# EAGLE design Hauptplatine (EAGLE 9.6.2)
Assembly variants: 1

## Sheet 1 of 12
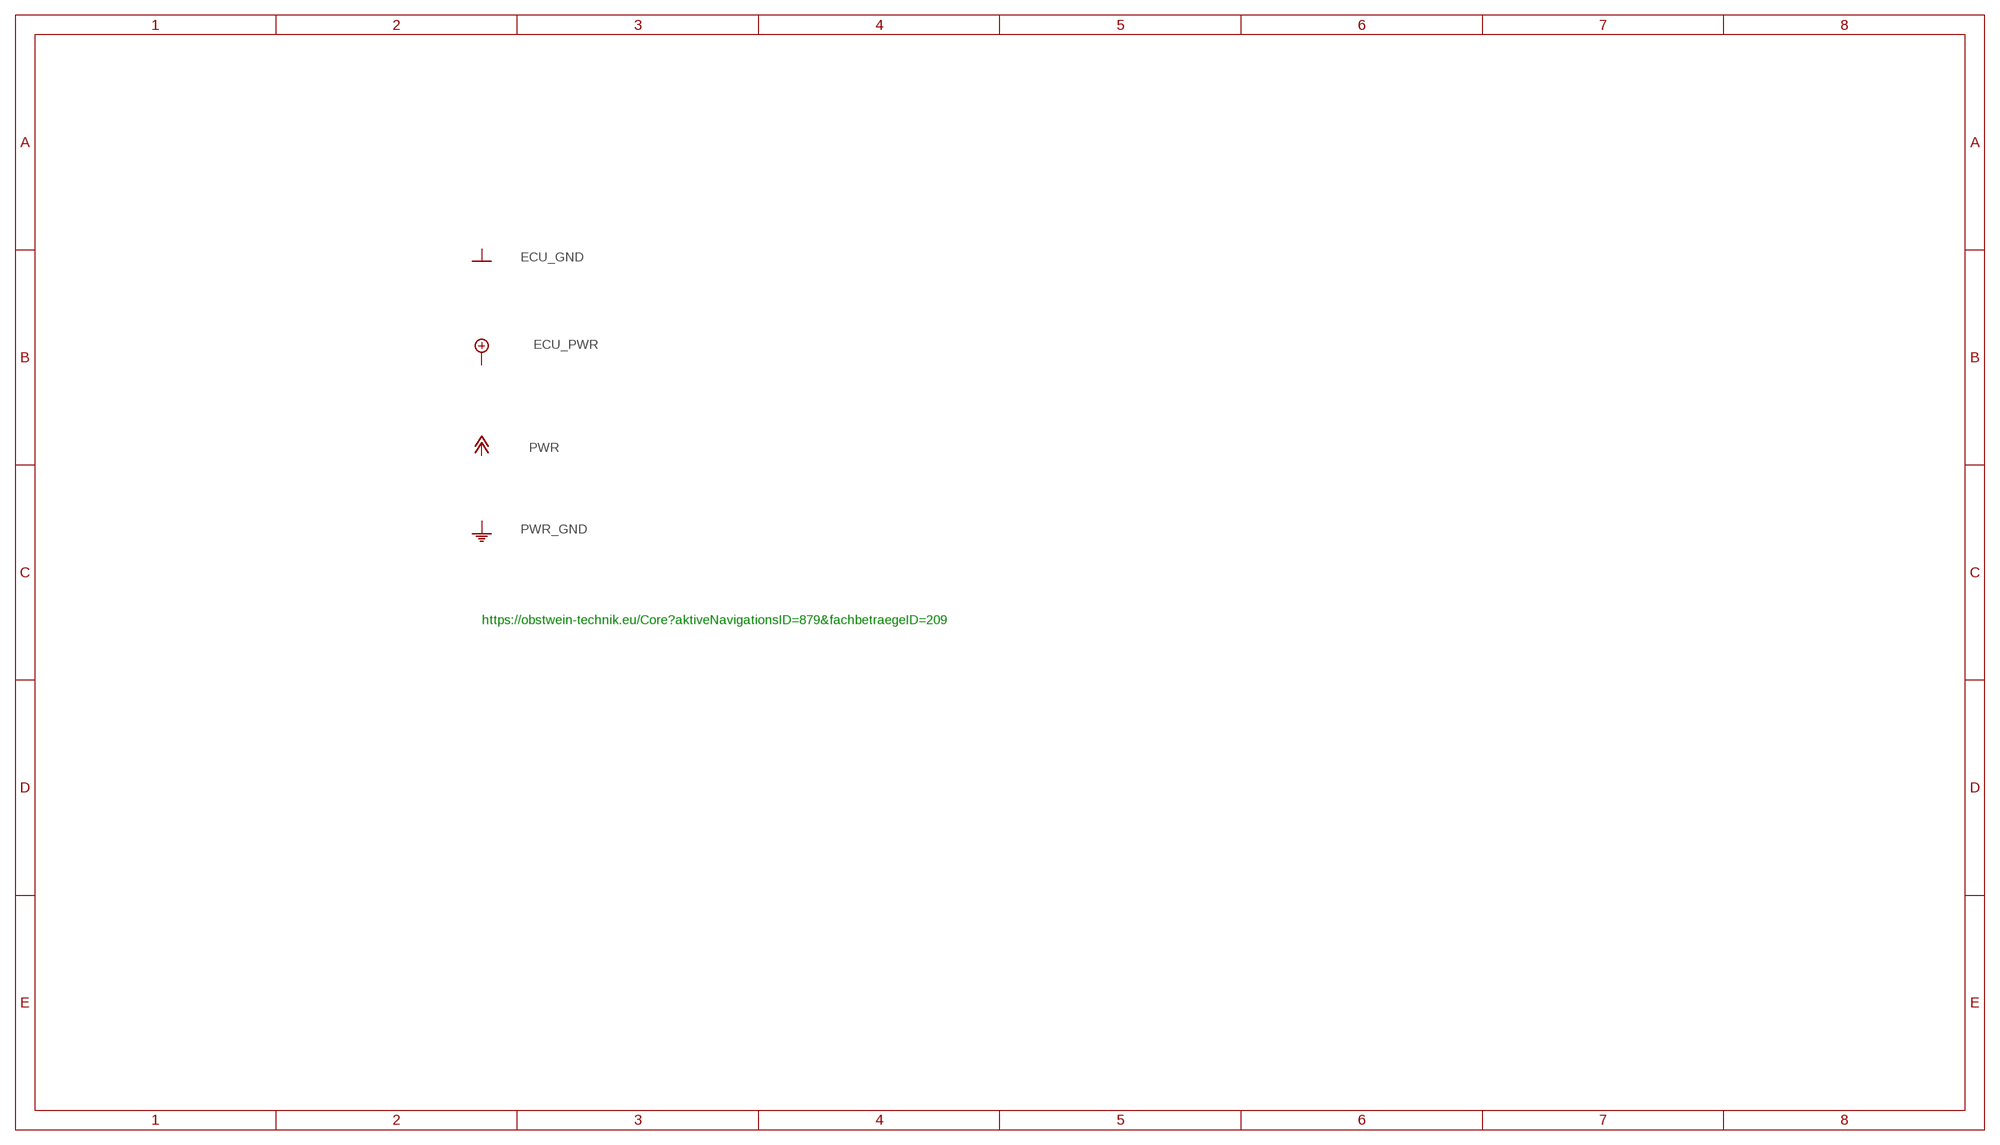
[diagram p0: schematic, sheet 1]

### Notes on the sheet
- https://obstwein-technik.eu/Core?aktiveNavigationsID=879&fachbetraegeID=209

## Sheet 2 of 12
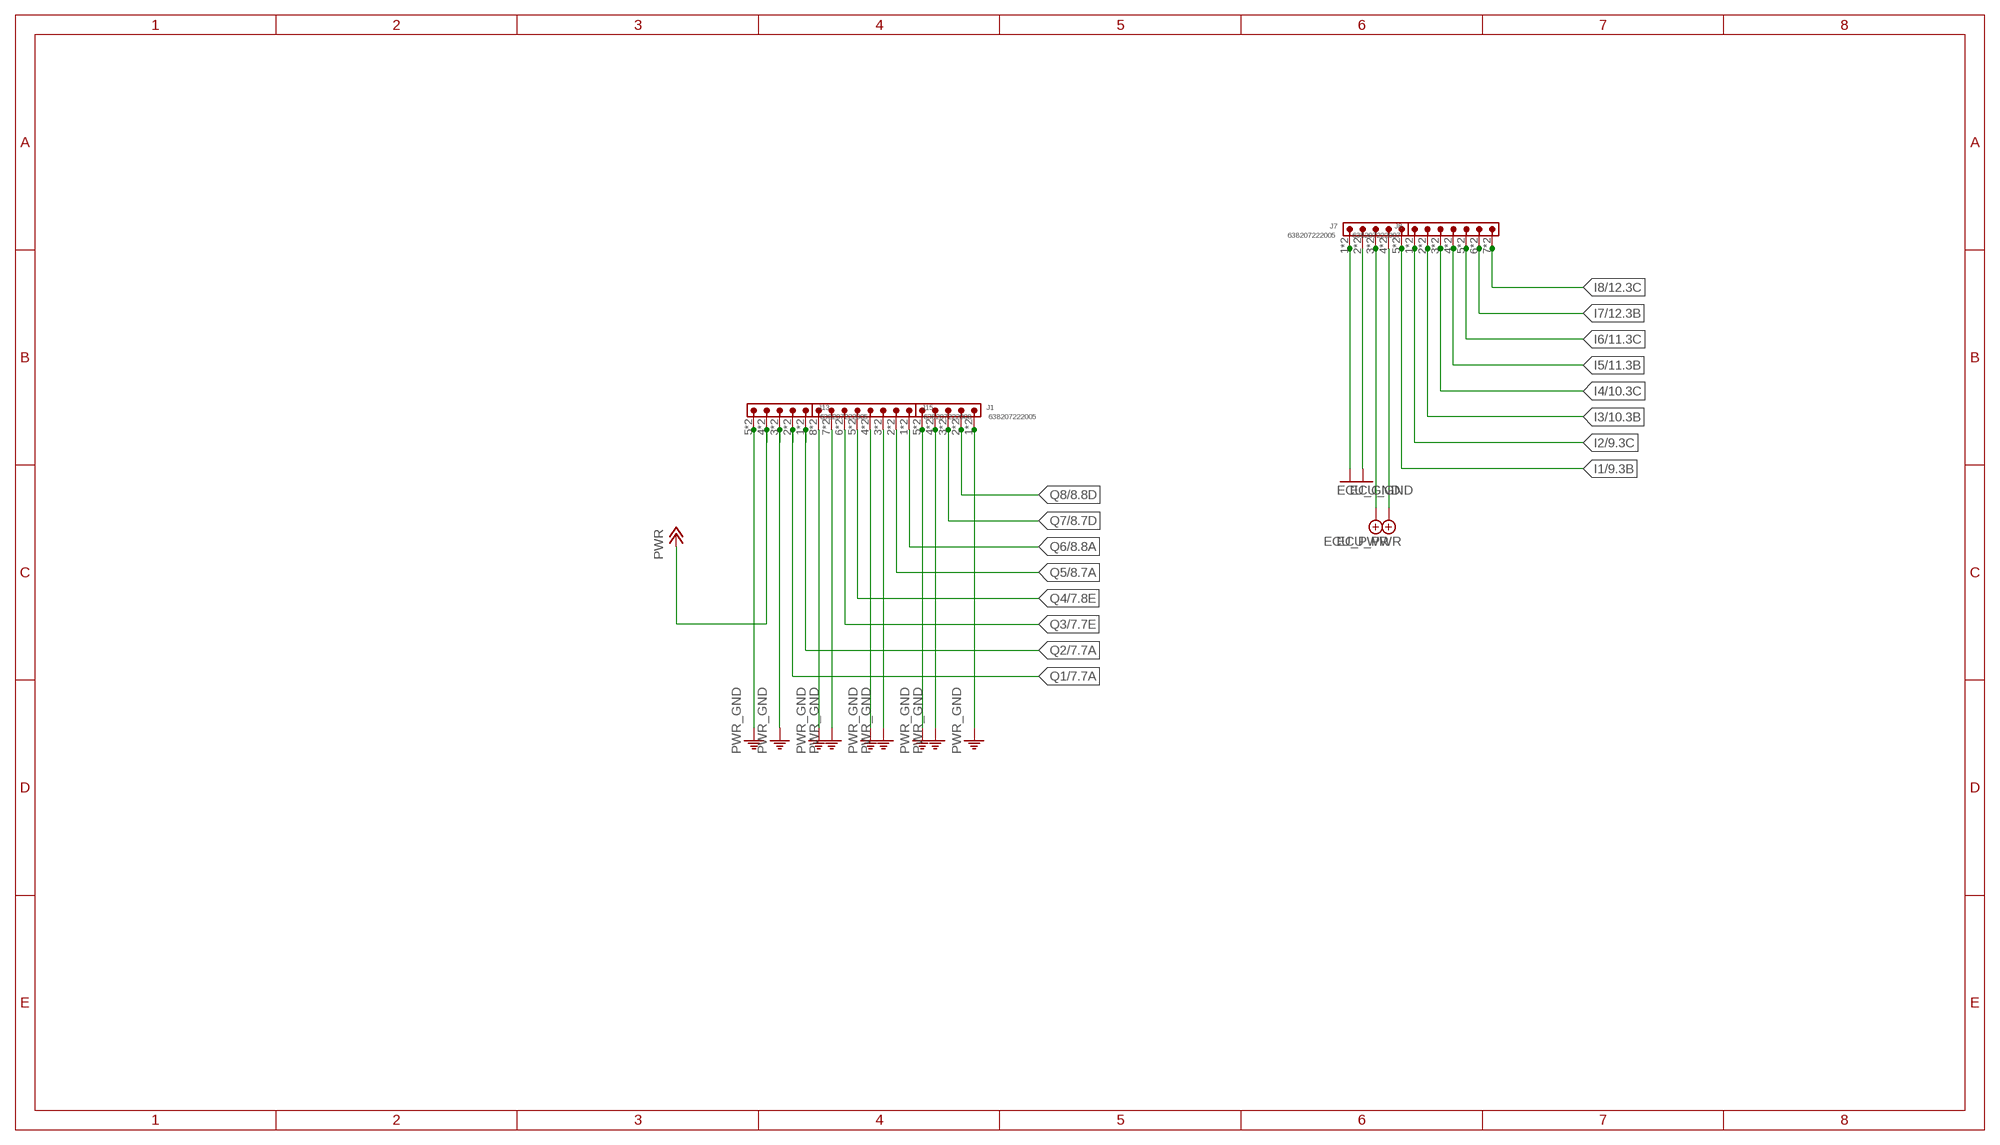
[diagram p1: schematic, sheet 2]

### Parts
J1  638207222005  638207222005  [638207222005]
J7  638207222005  638207222005  [638207222005]
J8  638207222007  638207222007  [638207222007]
J13  638207222005  638207222005  [638207222005]
J15  638207222008  638207222008  [638207222008]

### Nets
ECU_GND [GND]: J7.1 J7.2 J7.A1 J7.A2 ; also sheet 3,4,5,6,7,8,9,10,11,12
ECU_PWR: J7.3 J7.4 J7.A3 J7.A4 ; also sheet 3,7
I1: J7.5 J7.A5 ; also sheet 9
I2: J8.1 J8.A1 ; also sheet 9
I3: J8.2 J8.A2 ; also sheet 10
I4: J8.3 J8.A3 ; also sheet 10
I5: J8.4 J8.A4 ; also sheet 11
I6: J8.5 J8.A5 ; also sheet 11
I7: J8.6 J8.A6 ; also sheet 12
I8: J8.7 J8.A7 ; also sheet 12
PWR: J13.4 J13.A4 ; also sheet 7,8
PWR_GND: J1.1 J1.4 J1.5 J1.A1 J1.A4 J1.A5 J13.3 J13.5 J13.A3 J13.A5 J15.3 J15.4 J15.7 J15.8 J15.A3 J15.A4 J15.A7 J15.A8 ; also sheet 7,8
Q1: J13.2 J13.A2 ; also sheet 7
Q2: J13.1 J13.A1 ; also sheet 7
Q3: J15.6 J15.A6 ; also sheet 7
Q4: J15.5 J15.A5 ; also sheet 7
Q5: J15.2 J15.A2 ; also sheet 8
Q6: J15.1 J15.A1 ; also sheet 8
Q7: J1.3 J1.A3 ; also sheet 8
Q8: J1.2 J1.A2 ; also sheet 8

## Sheet 3 of 12
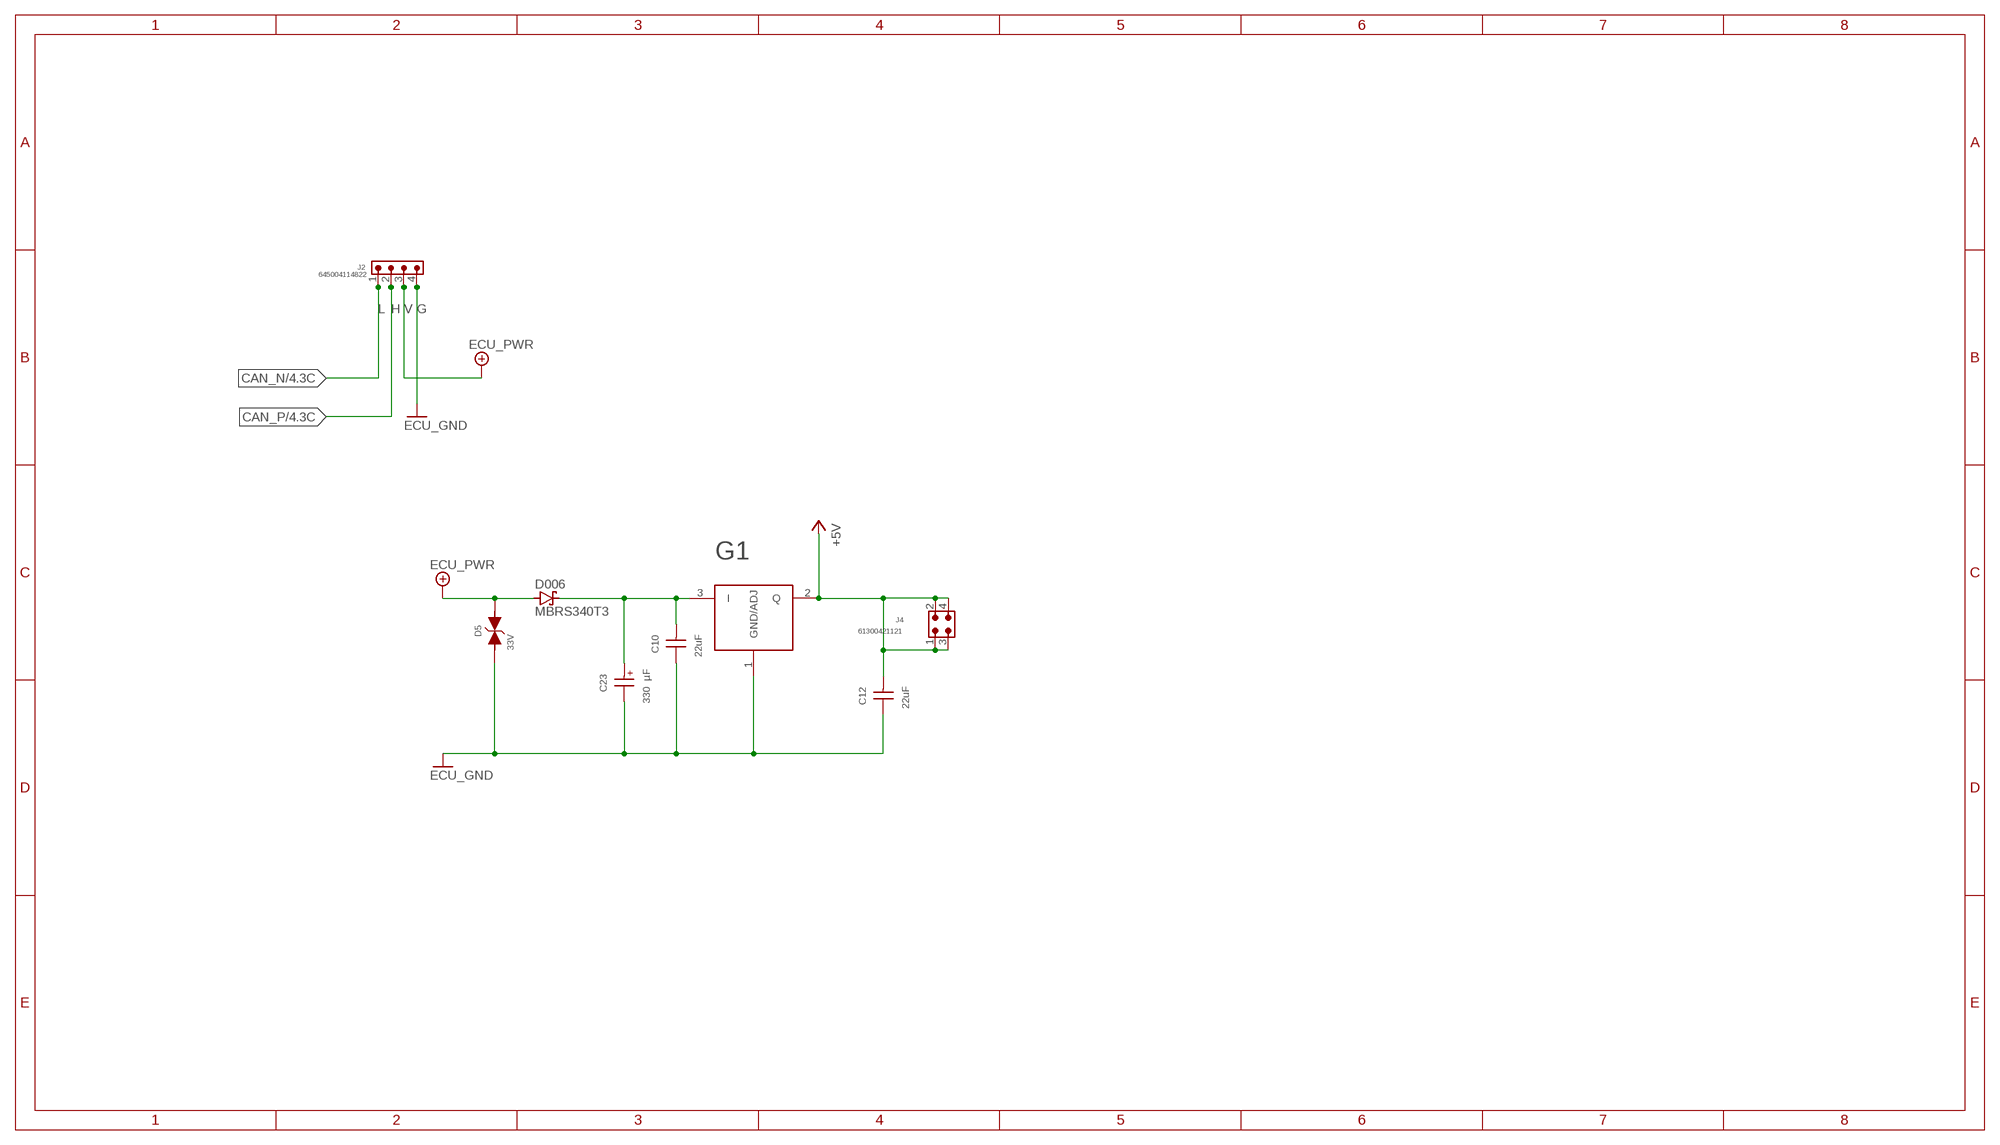
[diagram p2: schematic, sheet 3]

### Parts
C10  22uF  WCAP-CSGP_1210_H2.5_885012109014_25V(DC)  [WCAP-CSGP_1210_H2.5]
C12  22uF  WCAP-CSGP_0805_H1.25_885012107011_10V(DC)  [WCAP-CSGP_0805_H1.25_R]
C23  330 µF  WCAP-ASLI_12.5X14_865080662019  [WCAP-ASLI_12.5X14(DXL)]
D5  33V  WE-TVSP_DO-214AB_3000W_BI_824551331  [WE-TVSP_DO-214AB_BIDIRECTIONAL]
D006  MBRS340T3  [SMC]
G1  IFX27001TF_V50  [INF-PG-TO252-3-11_N]
J2  645004114822  [645004114822]
J4  61300421121  6130XX21121_61300421121  [61300421121]

### Nets
+5V: C12.2 G1.2(Q) J4.1 J4.2 J4.3 J4.4 ; also sheet 4,5,6
CAN_N: J2.1 ; also sheet 4
CAN_P: J2.2 ; also sheet 4
ECU_GND [GND]: C10.1 C12.1 C23.2(-) D5.1 G1.1(GND/ADJ) J2.4 ; also sheet 2,4,5,6,7,8,9,10,11,12
ECU_PWR: D5.2 D006.A J2.3 ; also sheet 2,7
N$3: C10.2 C23.1(+) D006.C G1.3(I)

### Notes on the sheet
- L | H | V | G

## Sheet 4 of 12
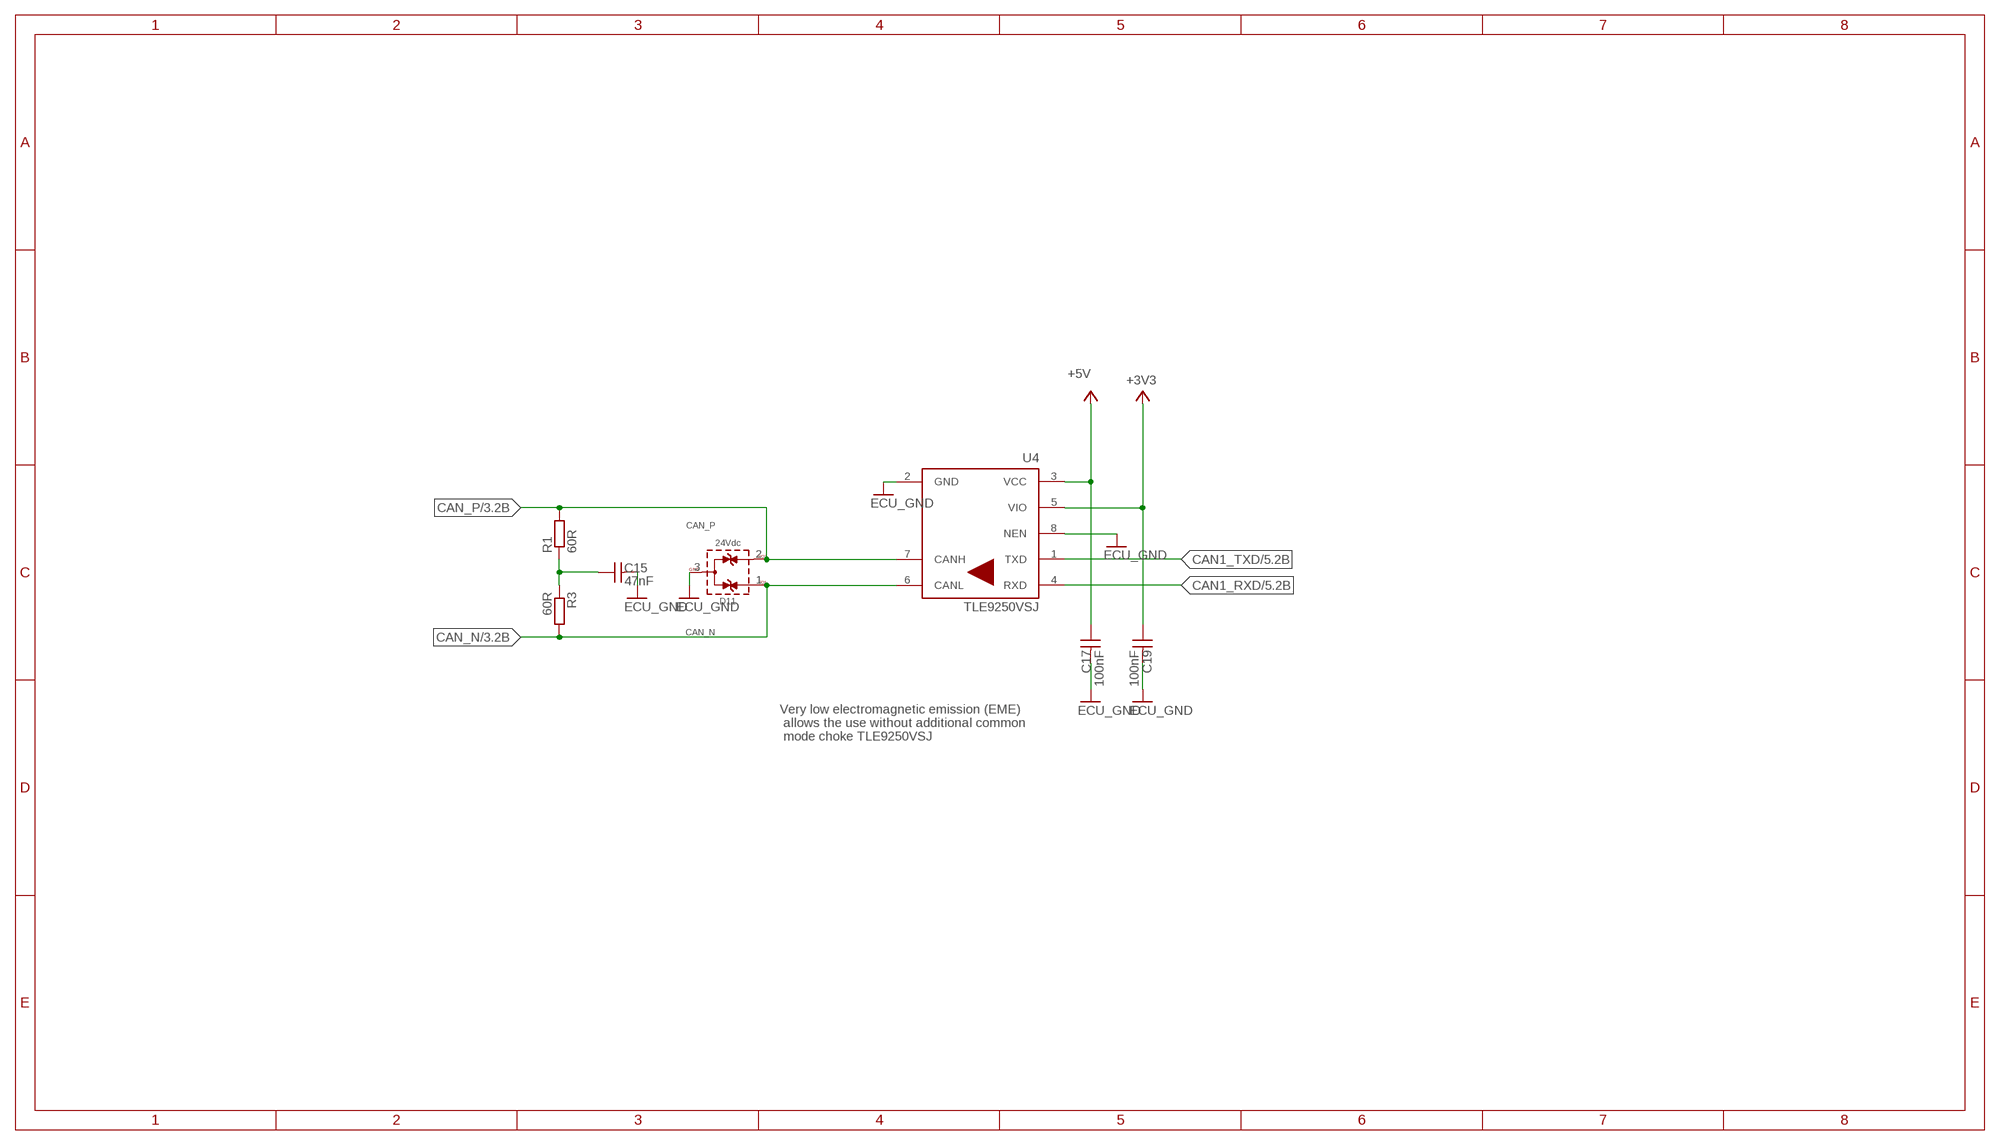
[diagram p3: schematic, sheet 4]

### Parts
C15  47nF  WCAP-CSGP_0805_H0.8_885012207096_50V(DC)_R  [WCAP-CSGP_0805_H0.8_R]
C17  100nF  WCAP-CSGP_0805_H0.8_885012207098_50V(DC)_R  [WCAP-CSGP_0805_H0.8_R]
C19  100nF  WCAP-CSGP_0805_H0.8_885012207098_50V(DC)_R  [WCAP-CSGP_0805_H0.8_R]
D11  24Vdc  WE-TVS_SOT23-3L_824094024  [WE-TVS_SOT23-3L]
R1  60R  R-EU_R0805  [R0805]
R3  60R  R-EU_R0805  [R0805]
U4  TLE9250VSJ  [SOIC127P602X173-8N-V]

### Nets
+3V3: C19.1 U4.5(VIO) ; also sheet 5,6,9,10,11,12
+5V: C17.1 U4.3(VCC) ; also sheet 3,5,6
CAN1_RXD: U4.4(RXD) ; also sheet 5,6
CAN1_TXD: U4.1(TXD) ; also sheet 5,6
CAN_N: D11.1(I/O1) R3.2 U4.6(CANL) ; also sheet 3
CAN_P: D11.2(I/O2) R1.2 U4.7(CANH) ; also sheet 3
ECU_GND [GND]: C15.2 C17.2 C19.2 D11.3(GND) U4.2(GND) U4.8(NEN) ; also sheet 2,3,5,6,7,8,9,10,11,12
N$17: C15.1 R1.1 R3.1

### Notes on the sheet
- Very low electromagnetic emission (EME)
   allows the use without additional common
   mode choke TLE9250VSJ

## Sheet 5 of 12
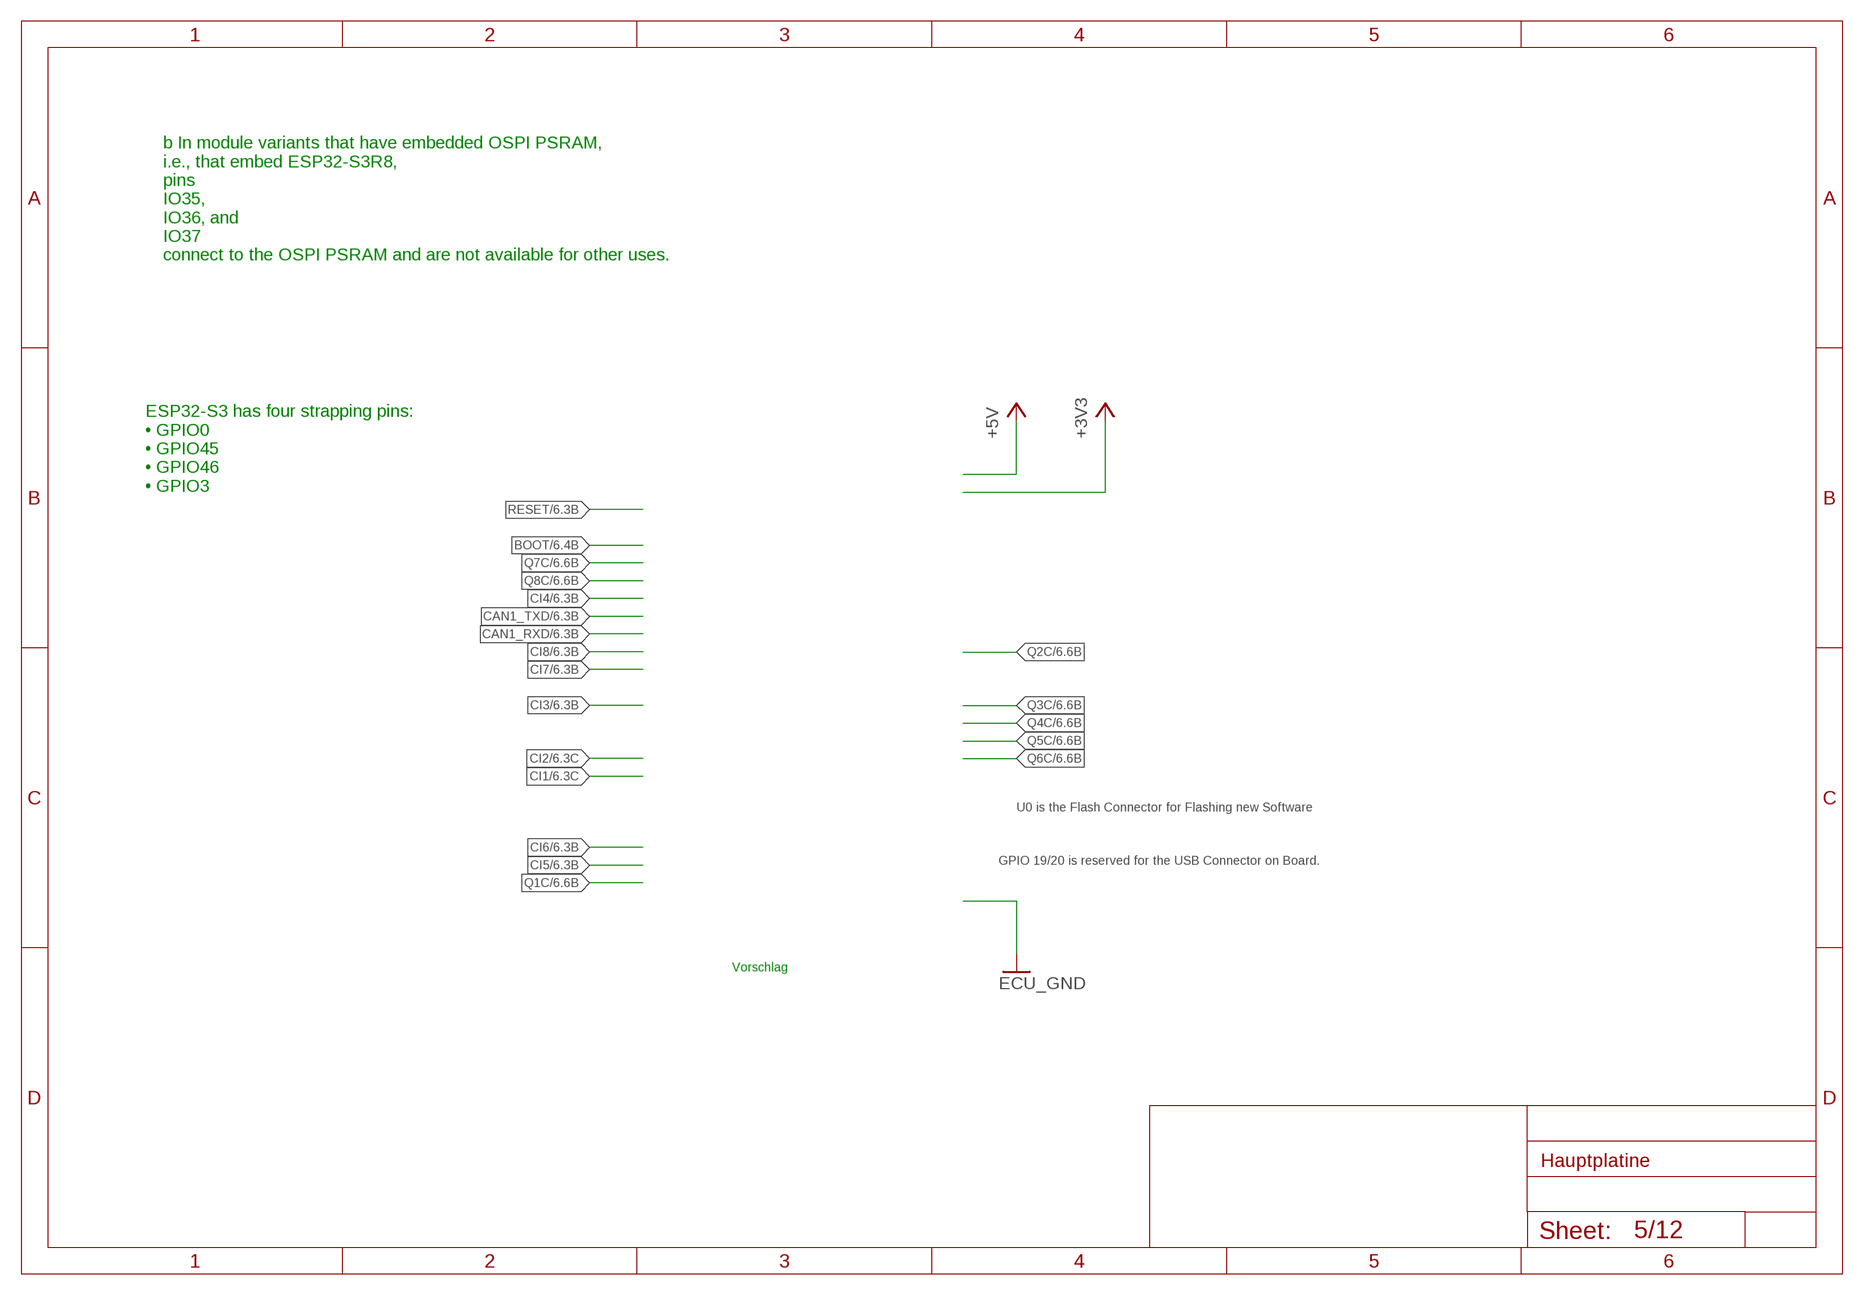
[diagram p4: schematic, sheet 5]

### Notes on the sheet
- b In module variants that have embedded OSPI PSRAM, 
  i.e., that embed ESP32-S3R8, 
  pins 
  IO35, 
  IO36, and 
  IO37 
  connect to the OSPI PSRAM and are not available for other uses.
- ESP32-S3 has four strapping pins: 
  • GPIO0 
  • GPIO45 
  • GPIO46 
  • GPIO3
- U0 is the Flash Connector for Flashing new Software
- GPIO 19/20 is reserved for the USB Connector on Board.
- Vorschlag

## Sheet 6 of 12
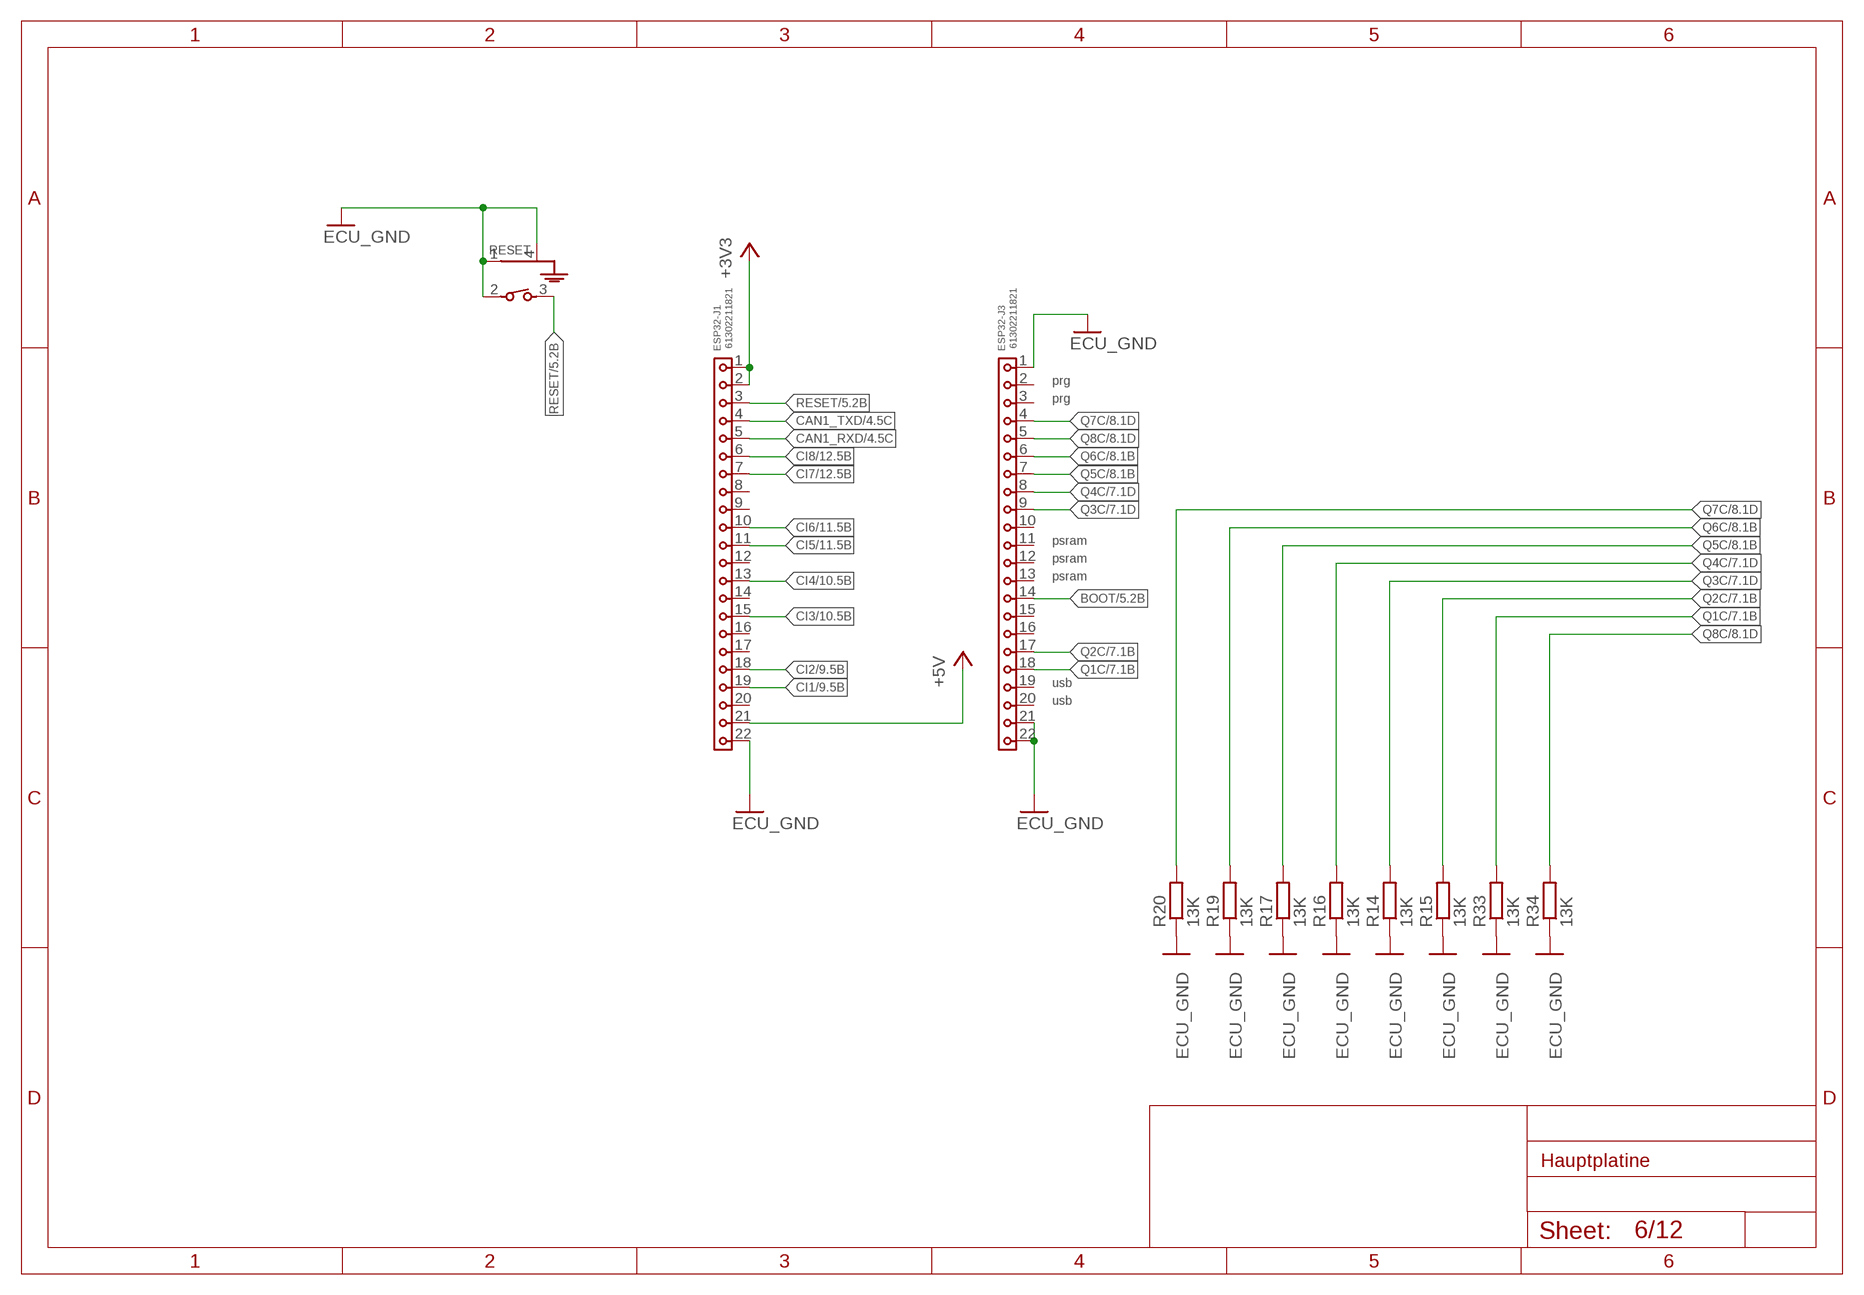
[diagram p5: schematic, sheet 6]

### Parts
ESP32-J1  61302211821  6130XX11821_61302211821  [61302211821]
ESP32-J3  61302211821  6130XX11821_61302211821  [61302211821]
R14  13K  R-EU_R1206  [R1206]
R15  13K  R-EU_R1206  [R1206]
R16  13K  R-EU_R1206  [R1206]
R17  13K  R-EU_R1206  [R1206]
R19  13K  R-EU_R1206  [R1206]
R20  13K  R-EU_R1206  [R1206]
R33  13K  R-EU_R1206  [R1206]
R34  13K  R-EU_R1206  [R1206]
RESET  431256083736  [4312560837X6]

### Nets
+3V3: ESP32-J1.1 ESP32-J1.2 ; also sheet 4,5,9,10,11,12
+5V: ESP32-J1.21 ; also sheet 3,4,5
BOOT: ESP32-J3.14 ; also sheet 5
CAN1_RXD: ESP32-J1.5 ; also sheet 4,5
CAN1_TXD: ESP32-J1.4 ; also sheet 4,5
CI1: ESP32-J1.19 ; also sheet 5,9
CI2: ESP32-J1.18 ; also sheet 5,9
CI3: ESP32-J1.15 ; also sheet 5,10
CI4: ESP32-J1.13 ; also sheet 5,10
CI5: ESP32-J1.11 ; also sheet 5,11
CI6: ESP32-J1.10 ; also sheet 5,11
CI7: ESP32-J1.7 ; also sheet 5,12
CI8: ESP32-J1.6 ; also sheet 5,12
ECU_GND [GND]: ESP32-J1.22 ESP32-J3.1 ESP32-J3.21 ESP32-J3.22 R14.1 R15.1 R16.1 R17.1 R19.1 R20.1 R33.1 R34.1 RESET.1(GND1) RESET.2 RESET.4(GND) ; also sheet 2,3,4,5,7,8,9,10,11,12
Q1C: ESP32-J3.18 R33.2 ; also sheet 5,7
Q2C: ESP32-J3.17 R15.2 ; also sheet 5,7
Q3C: ESP32-J3.9 R14.2 ; also sheet 5,7
Q4C: ESP32-J3.8 R16.2 ; also sheet 5,7
Q5C: ESP32-J3.7 R17.2 ; also sheet 5,8
Q6C: ESP32-J3.6 R19.2 ; also sheet 5,8
Q7C: ESP32-J3.4 R20.2 ; also sheet 5,8
Q8C: ESP32-J3.5 R34.2 ; also sheet 5,8
RESET: ESP32-J1.3 RESET.3 ; also sheet 5
Unconnected: ESP32-J1.8 ESP32-J1.9 ESP32-J1.12 ESP32-J1.14 ESP32-J1.16 ESP32-J1.17 ESP32-J1.20 ESP32-J3.2 ESP32-J3.3 ESP32-J3.10 ESP32-J3.11 ESP32-J3.12 ESP32-J3.13 ESP32-J3.15 ESP32-J3.16 ESP32-J3.19 ESP32-J3.20

### Notes on the sheet
- prg
- prg
- psram
- psram
- psram
- usb
- usb

## Sheet 7 of 12
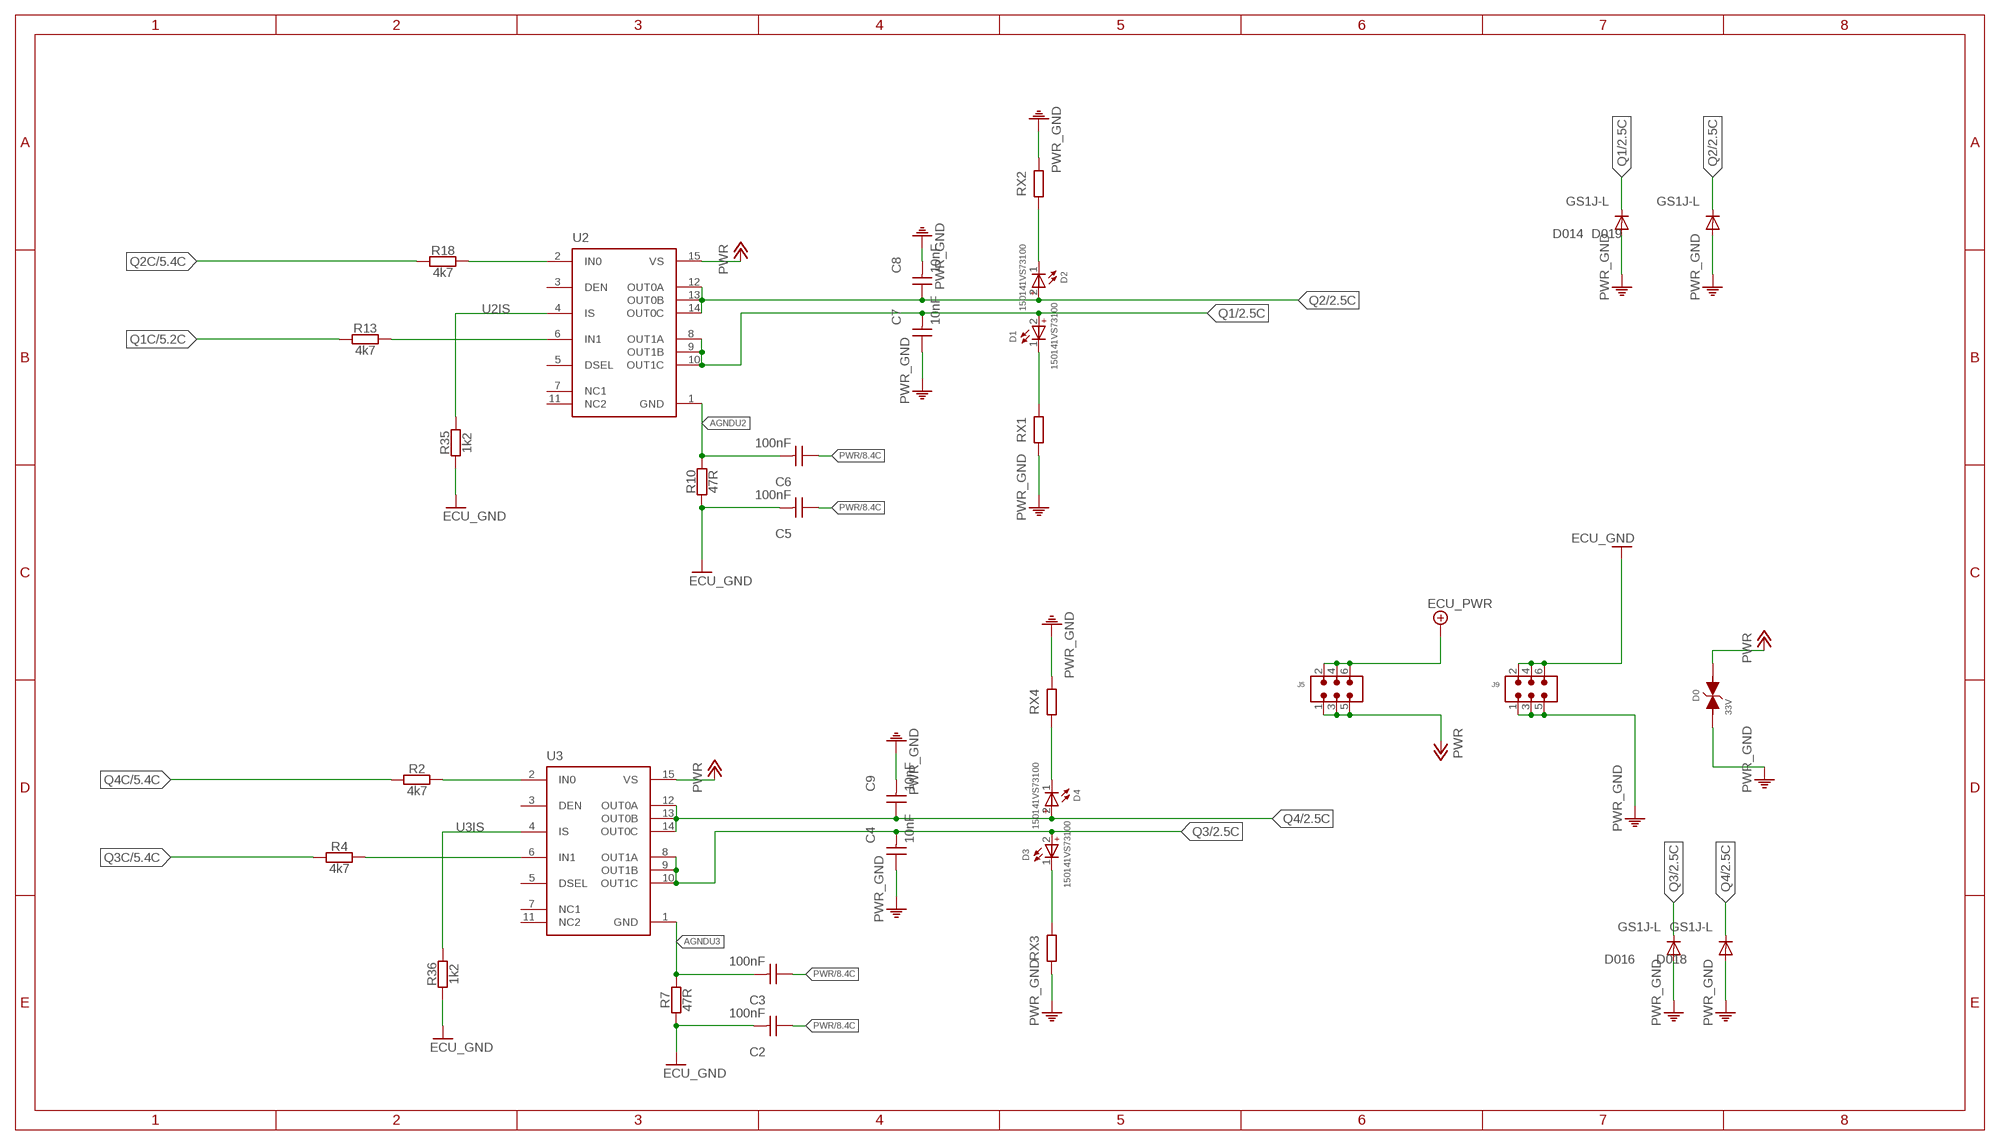
[diagram p6: schematic, sheet 7]

### Parts
C2  100nF  WCAP-CSGP_0805_H0.8_885012207098_50V(DC)_R  [WCAP-CSGP_0805_H0.8_R]
C3  100nF  WCAP-CSGP_0805_H0.8_885012207098_50V(DC)_R  [WCAP-CSGP_0805_H0.8_R]
C4  10nF  WCAP-CSGP_0805_H0.8_885012207092_50V(DC)_R  [WCAP-CSGP_0805_H0.8_R]
C5  100nF  WCAP-CSGP_0805_H0.8_885012207098_50V(DC)_R  [WCAP-CSGP_0805_H0.8_R]
C6  100nF  WCAP-CSGP_0805_H0.8_885012207098_50V(DC)_R  [WCAP-CSGP_0805_H0.8_R]
C7  10nF  WCAP-CSGP_0805_H0.8_885012207092_50V(DC)_R  [WCAP-CSGP_0805_H0.8_R]
C8  10nF  WCAP-CSGP_0805_H0.8_885012207092_50V(DC)_R  [WCAP-CSGP_0805_H0.8_R]
C9  10nF  WCAP-CSGP_0805_H0.8_885012207092_50V(DC)_R  [WCAP-CSGP_0805_H0.8_R]
D0  33V  WE-TVSP_DO-214AB_3000W_BI_824551331  [WE-TVSP_DO-214AB_BIDIRECTIONAL]
D1  150141VS73100  WL-SMTW_3528_150141VS73100  [WL-SMTW_3528]
D2  150141VS73100  WL-SMTW_3528_150141VS73100  [WL-SMTW_3528]
D3  150141VS73100  WL-SMTW_3528_150141VS73100  [WL-SMTW_3528]
D4  150141VS73100  WL-SMTW_3528_150141VS73100  [WL-SMTW_3528]
D014  GS1J-L  [SMA_DO-214AC]
D016  GS1J-L  [SMA_DO-214AC]
D018  GS1J-L  [SMA_DO-214AC]
D019  GS1J-L  [SMA_DO-214AC]
J5  6130XX21121_61300621121  [61300621121]
J9  6130XX21121_61300621121  [61300621121]
R2  4k7  R-EU_R0805  [R0805]
R4  4k7  R-EU_R0805  [R0805]
R7  47R  R-EU_R0805  [R0805]
R10  47R  R-EU_R0805  [R0805]
R13  4k7  R-EU_R0805  [R0805]
R18  4k7  R-EU_R0805  [R0805]
R35  1k2  R-EU_R0805  [R0805]
R36  1k2  R-EU_R0805  [R0805]
RX1  470Ohm  R-EU_R1206  [R1206]
RX2  470Ohm  R-EU_R1206  [R1206]
RX3  470Ohm  R-EU_R1206  [R1206]
RX4  470Ohm  R-EU_R1206  [R1206]
U2  BTS7030-2EPA  [SOP65P600X115-15N-V]
U3  BTS7030-2EPA  [SOP65P600X115-15N-V]

### Nets
AGNDU2: C6.2 R10.2 U2.1(GND)
AGNDU3: C3.2 R7.2 U3.1(GND)
ECU_GND [GND]: C2.2 C5.2 J9.2 J9.4 J9.6 R7.1 R10.1 R35.1 R36.1 ; also sheet 2,3,4,5,6,8,9,10,11,12
ECU_PWR: J5.2 J5.4 J5.6 ; also sheet 2,3
N$1 [GND]: D4.1(-) RX4.1
N$2: R2.2 U3.2(IN0)
N$4: R4.2 U3.6(IN1)
N$6 [GND]: D2.1(-) RX2.1
N$8 [GND]: D1.1(-) RX1.2
N$9 [GND]: D3.1(-) RX3.2
N$10: R18.2 U2.2(IN0)
N$14: R13.2 U2.6(IN1)
PWR: C2.1 C3.1 C5.1 C6.1 D0.2 J5.1 J5.3 J5.5 U2.15(VS) U3.15(VS) ; also sheet 2,8
PWR_GND: C4.1 C7.1 C8.2 C9.2 D0.1 D014.A D016.A D018.A D019.A J9.1 J9.3 J9.5 RX1.1 RX2.2 RX3.1 RX4.2 ; also sheet 2,8
Q1: C7.2 D1.2(+) D014.C U2.8(OUT1A) U2.9(OUT1B) U2.10(OUT1C) ; also sheet 2
Q1C: R13.1 ; also sheet 5,6
Q2: C8.1 D2.2(+) D019.C U2.12(OUT0A) U2.13(OUT0B) U2.14(OUT0C) ; also sheet 2
Q2C: R18.1 ; also sheet 5,6
Q3: C4.2 D3.2(+) D016.C U3.8(OUT1A) U3.9(OUT1B) U3.10(OUT1C) ; also sheet 2
Q3C: R4.1 ; also sheet 5,6
Q4: C9.1 D4.2(+) D018.C U3.12(OUT0A) U3.13(OUT0B) U3.14(OUT0C) ; also sheet 2
Q4C: R2.1 ; also sheet 5,6
U2IS: R35.2 U2.4(IS)
U3IS: R36.2 U3.4(IS)
Unconnected: U2.3(DEN) U2.5(DSEL) U2.7(NC1) U2.11(NC2) U3.3(DEN) U3.5(DSEL) U3.7(NC1) U3.11(NC2)

## Sheet 8 of 12
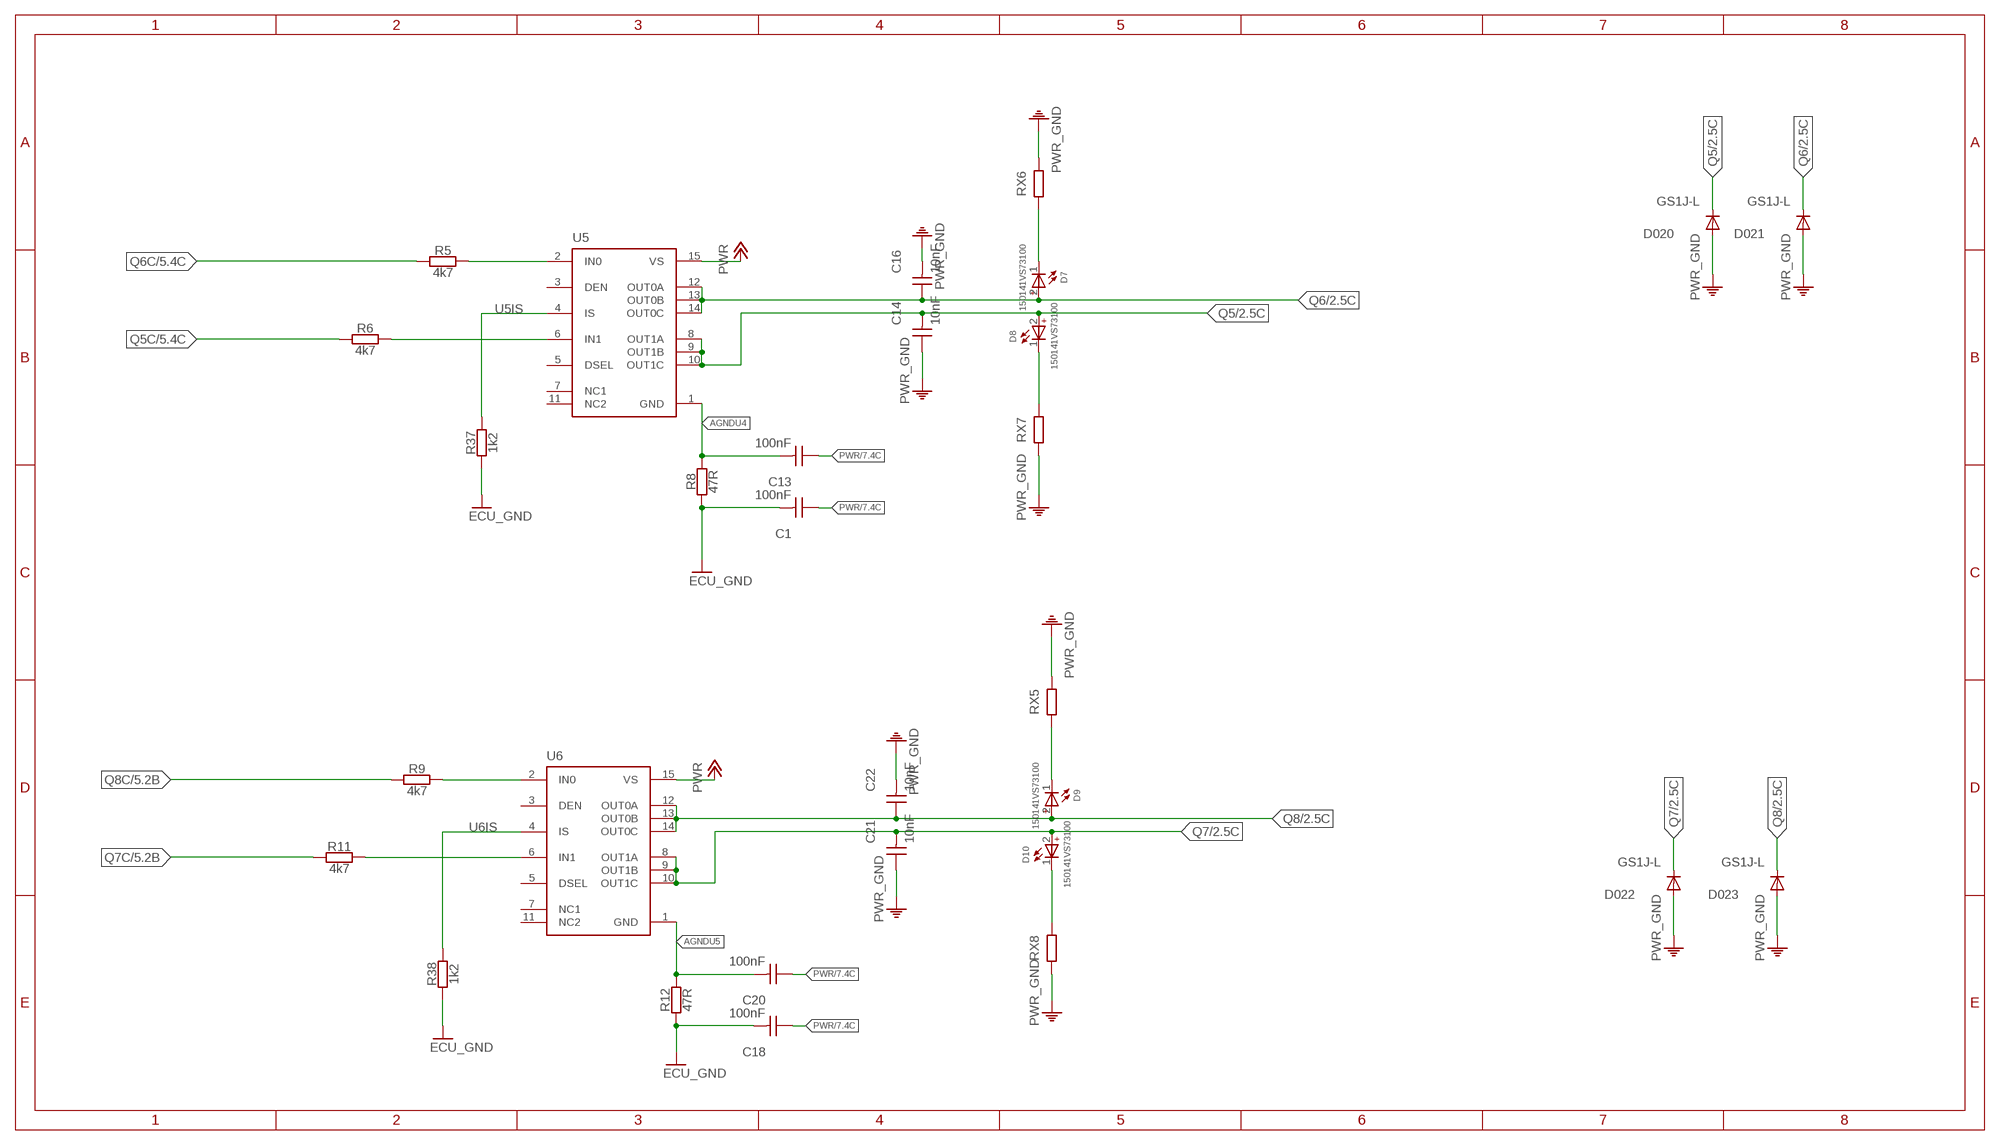
[diagram p7: schematic, sheet 8]

### Parts
C1  100nF  WCAP-CSGP_0805_H0.8_885012207098_50V(DC)_R  [WCAP-CSGP_0805_H0.8_R]
C13  100nF  WCAP-CSGP_0805_H0.8_885012207098_50V(DC)_R  [WCAP-CSGP_0805_H0.8_R]
C14  10nF  WCAP-CSGP_0805_H0.8_885012207092_50V(DC)_R  [WCAP-CSGP_0805_H0.8_R]
C16  10nF  WCAP-CSGP_0805_H0.8_885012207092_50V(DC)_R  [WCAP-CSGP_0805_H0.8_R]
C18  100nF  WCAP-CSGP_0805_H0.8_885012207098_50V(DC)_R  [WCAP-CSGP_0805_H0.8_R]
C20  100nF  WCAP-CSGP_0805_H0.8_885012207098_50V(DC)_R  [WCAP-CSGP_0805_H0.8_R]
C21  10nF  WCAP-CSGP_0805_H0.8_885012207092_50V(DC)_R  [WCAP-CSGP_0805_H0.8_R]
C22  10nF  WCAP-CSGP_0805_H0.8_885012207092_50V(DC)_R  [WCAP-CSGP_0805_H0.8_R]
D7  150141VS73100  WL-SMTW_3528_150141VS73100  [WL-SMTW_3528]
D8  150141VS73100  WL-SMTW_3528_150141VS73100  [WL-SMTW_3528]
D9  150141VS73100  WL-SMTW_3528_150141VS73100  [WL-SMTW_3528]
D10  150141VS73100  WL-SMTW_3528_150141VS73100  [WL-SMTW_3528]
D020  GS1J-L  [SMA_DO-214AC]
D021  GS1J-L  [SMA_DO-214AC]
D022  GS1J-L  [SMA_DO-214AC]
D023  GS1J-L  [SMA_DO-214AC]
R5  4k7  R-EU_R0805  [R0805]
R6  4k7  R-EU_R0805  [R0805]
R8  47R  R-EU_R0805  [R0805]
R9  4k7  R-EU_R0805  [R0805]
R11  4k7  R-EU_R0805  [R0805]
R12  47R  R-EU_R0805  [R0805]
R37  1k2  R-EU_R0805  [R0805]
R38  1k2  R-EU_R0805  [R0805]
RX5  470Ohm  R-EU_R1206  [R1206]
RX6  470Ohm  R-EU_R1206  [R1206]
RX7  470Ohm  R-EU_R1206  [R1206]
RX8  470Ohm  R-EU_R1206  [R1206]
U5  BTS7030-2EPA  [SOP65P600X115-15N-V]
U6  BTS7030-2EPA  [SOP65P600X115-15N-V]

### Nets
+6V [GND]: D7.1(-) RX6.1
AGNDU4: C13.2 R8.2 U5.1(GND)
AGNDU5: C20.2 R12.2 U6.1(GND)
ECU_GND [GND]: C1.2 C18.2 R8.1 R12.1 R37.1 R38.1 ; also sheet 2,3,4,5,6,7,9,10,11,12
N$5: R5.2 U5.2(IN0)
N$11: R6.2 U5.6(IN1)
N$12: R9.2 U6.2(IN0)
N$13: R11.2 U6.6(IN1)
N$15 [GND]: D9.1(-) RX5.1
N$18 [GND]: D8.1(-) RX7.2
N$19 [GND]: D10.1(-) RX8.2
PWR: C1.1 C13.1 C18.1 C20.1 U5.15(VS) U6.15(VS) ; also sheet 2,7
PWR_GND: C14.1 C16.2 C21.1 C22.2 D020.A D021.A D022.A D023.A RX5.2 RX6.2 RX7.1 RX8.1 ; also sheet 2,7
Q5: C14.2 D8.2(+) D020.C U5.8(OUT1A) U5.9(OUT1B) U5.10(OUT1C) ; also sheet 2
Q5C: R6.1 ; also sheet 5,6
Q6: C16.1 D7.2(+) D021.C U5.12(OUT0A) U5.13(OUT0B) U5.14(OUT0C) ; also sheet 2
Q6C: R5.1 ; also sheet 5,6
Q7: C21.2 D10.2(+) D022.C U6.8(OUT1A) U6.9(OUT1B) U6.10(OUT1C) ; also sheet 2
Q7C: R11.1 ; also sheet 5,6
Q8: C22.1 D9.2(+) D023.C U6.12(OUT0A) U6.13(OUT0B) U6.14(OUT0C) ; also sheet 2
Q8C: R9.1 ; also sheet 5,6
U5IS: R37.2 U5.4(IS)
U6IS: R38.2 U6.4(IS)
Unconnected: U5.3(DEN) U5.5(DSEL) U5.7(NC1) U5.11(NC2) U6.3(DEN) U6.5(DSEL) U6.7(NC1) U6.11(NC2)

## Sheet 9 of 12
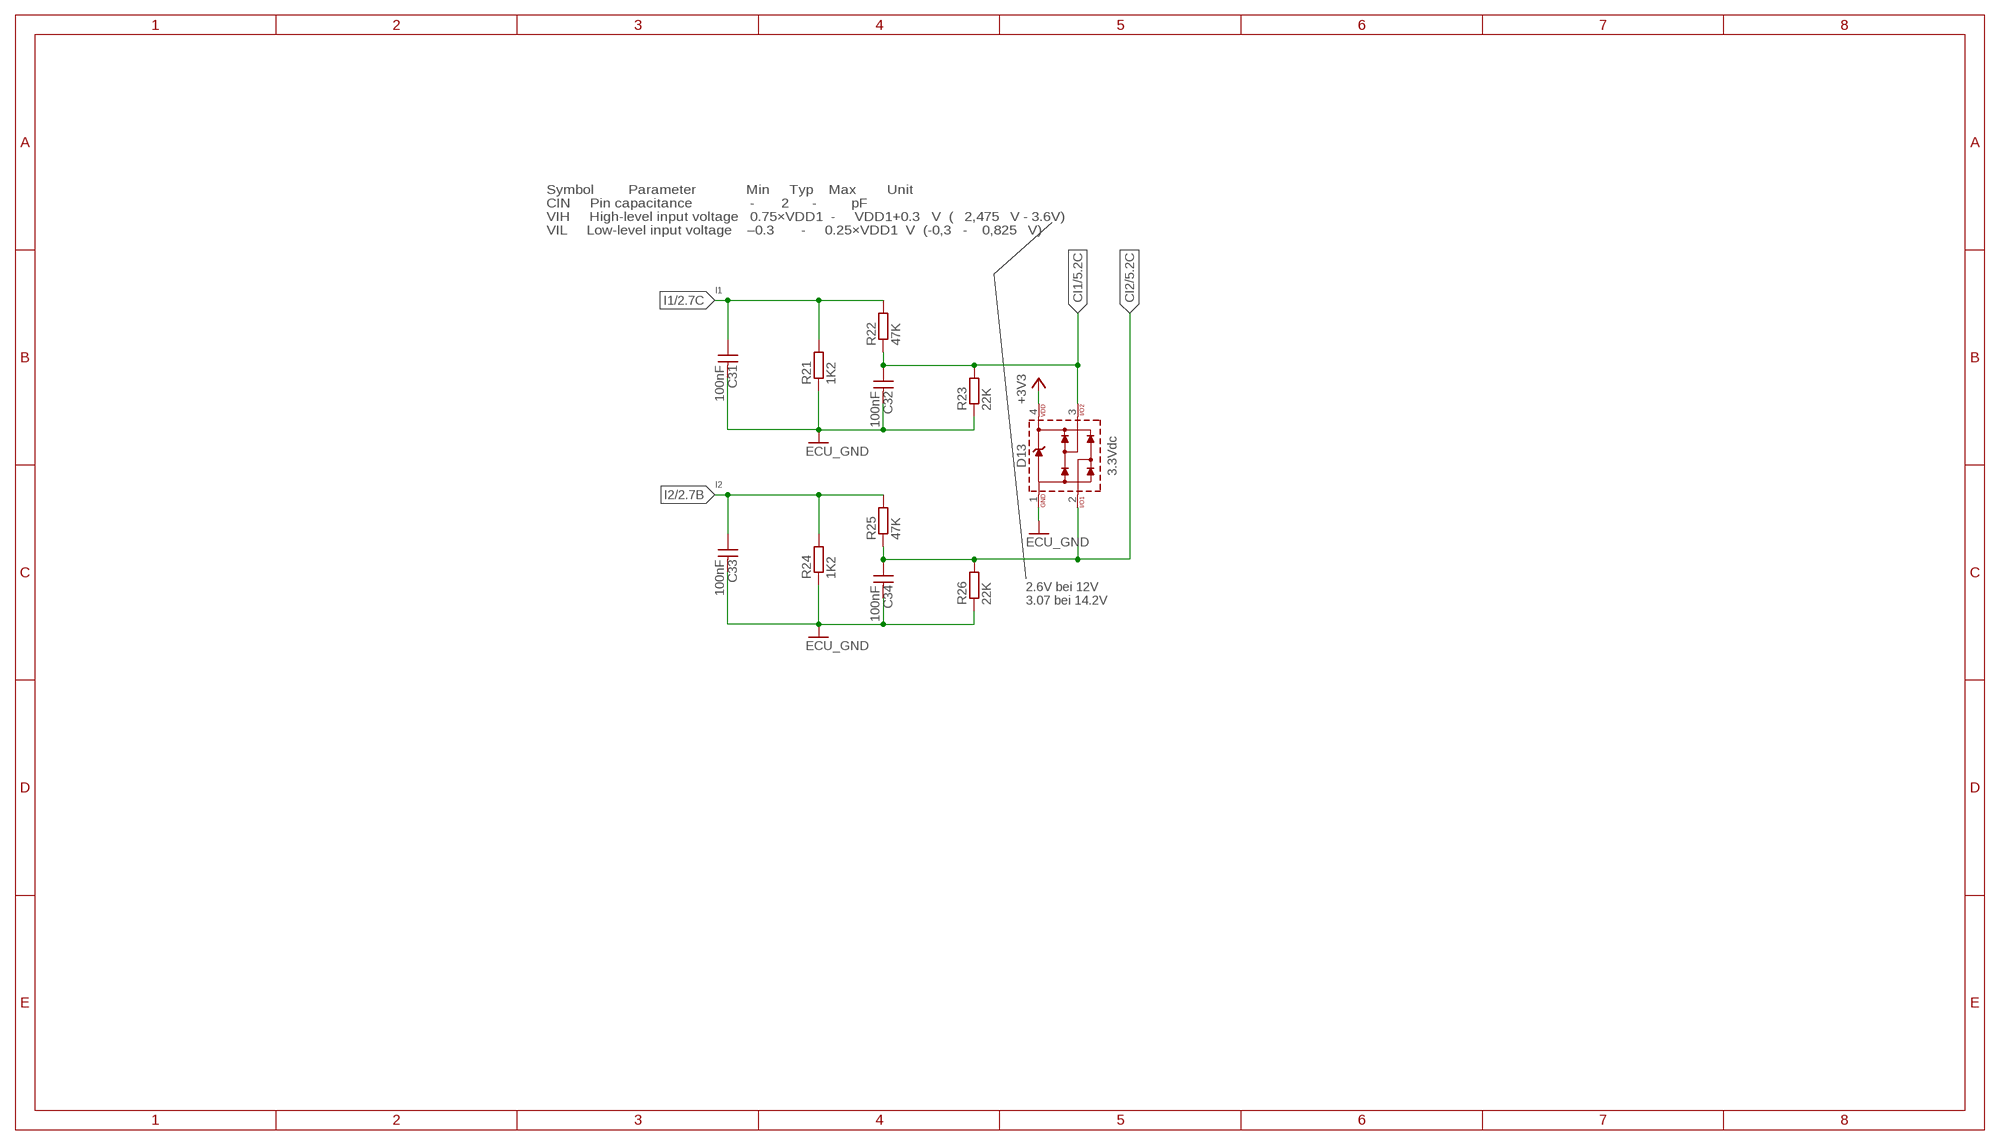
[diagram p8: schematic, sheet 9]

### Parts
C31  100nF  WCAP-CSGP_1206_H0.8_885012208087_50V(DC)  [WCAP-CSGP_1206_H0.8]
C32  100nF  WCAP-CSGP_1206_H0.8_885012208087_50V(DC)  [WCAP-CSGP_1206_H0.8]
C33  100nF  WCAP-CSGP_1206_H0.8_885012208087_50V(DC)  [WCAP-CSGP_1206_H0.8]
C34  100nF  WCAP-CSGP_1206_H0.8_885012208087_50V(DC)  [WCAP-CSGP_1206_H0.8]
D13  3.3Vdc  WE-TVS-HS_SOT143-4L_8240136  [WE-TVS_SOT143-4L]
R21  1K2  R-EU_R1206  [R1206]
R22  47K  R-EU_R1206  [R1206]
R23  22K  R-EU_R1206  [R1206]
R24  1K2  R-EU_R1206  [R1206]
R25  47K  R-EU_R1206  [R1206]
R26  22K  R-EU_R1206  [R1206]

### Nets
+3V3: D13.4(VDD) ; also sheet 4,5,6,10,11,12
CI1: C32.1 D13.3 R22.1 R23.2 ; also sheet 5,6
CI2: C34.1 D13.2 R25.1 R26.2 ; also sheet 5,6
ECU_GND [GND]: C31.2 C32.2 C33.2 C34.2 D13.1(GND) R21.1 R23.1 R24.1 R26.1 ; also sheet 2,3,4,5,6,7,8,10,11,12
I1: C31.1 R21.2 R22.2 ; also sheet 2
I2: C33.1 R24.2 R25.2 ; also sheet 2

### Notes on the sheet
- Symbol         Parameter             Min     Typ    Max        Unit
  CIN     Pin capacitance               -       2      -         pF
  VIH     High-level input voltage   0.75×VDD1  -     VDD1+0.3   V  (‭2,475‬V - 3.6V)
  VIL     Low-level input voltage    –0.3       -     0.25×VDD1  V  (-0,3   - ‭0,825‬V)
- 2.6V bei 12V
  3.07 bei 14.2V

## Sheet 10 of 12
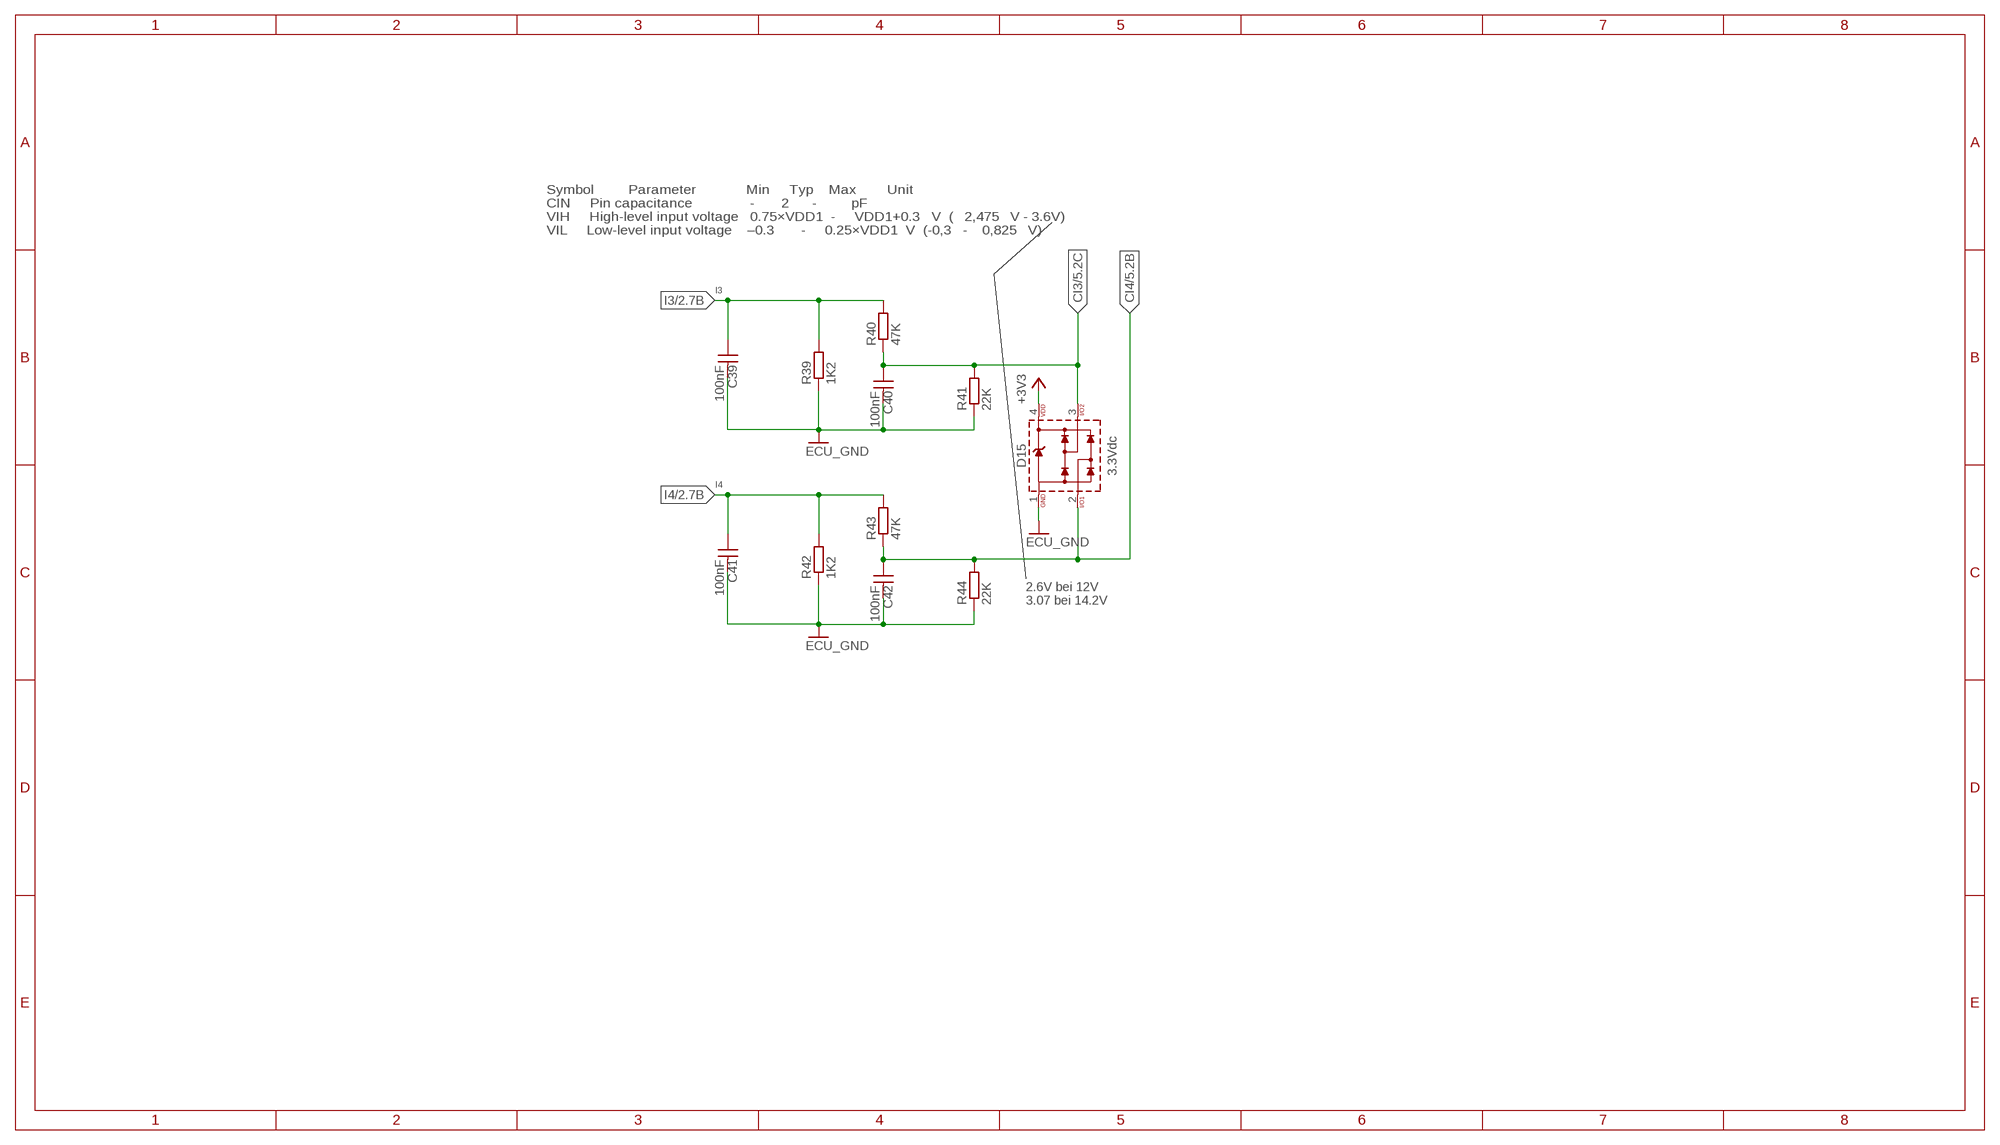
[diagram p9: schematic, sheet 10]

### Parts
C39  100nF  WCAP-CSGP_1206_H0.8_885012208087_50V(DC)  [WCAP-CSGP_1206_H0.8]
C40  100nF  WCAP-CSGP_1206_H0.8_885012208087_50V(DC)  [WCAP-CSGP_1206_H0.8]
C41  100nF  WCAP-CSGP_1206_H0.8_885012208087_50V(DC)  [WCAP-CSGP_1206_H0.8]
C42  100nF  WCAP-CSGP_1206_H0.8_885012208087_50V(DC)  [WCAP-CSGP_1206_H0.8]
D15  3.3Vdc  WE-TVS-HS_SOT143-4L_8240136  [WE-TVS_SOT143-4L]
R39  1K2  R-EU_R1206  [R1206]  (not fitted in variant 1)
R40  47K  R-EU_R1206  [R1206]
R41  22K  R-EU_R1206  [R1206]
R42  1K2  R-EU_R1206  [R1206]  (not fitted in variant 1)
R43  47K  R-EU_R1206  [R1206]
R44  22K  R-EU_R1206  [R1206]

### Nets
+3V3: D15.4(VDD) ; also sheet 4,5,6,9,11,12
CI3: C40.1 D15.3 R40.1 R41.2 ; also sheet 5,6
CI4: C42.1 D15.2 R43.1 R44.2 ; also sheet 5,6
ECU_GND [GND]: C39.2 C40.2 C41.2 C42.2 D15.1(GND) R39.1 R41.1 R42.1 R44.1 ; also sheet 2,3,4,5,6,7,8,9,11,12
I3: C39.1 R39.2 R40.2 ; also sheet 2
I4: C41.1 R42.2 R43.2 ; also sheet 2

### Notes on the sheet
- Symbol         Parameter             Min     Typ    Max        Unit
  CIN     Pin capacitance               -       2      -         pF
  VIH     High-level input voltage   0.75×VDD1  -     VDD1+0.3   V  (‭2,475‬V - 3.6V)
  VIL     Low-level input voltage    –0.3       -     0.25×VDD1  V  (-0,3   - ‭0,825‬V)
- 2.6V bei 12V
  3.07 bei 14.2V

## Sheet 11 of 12
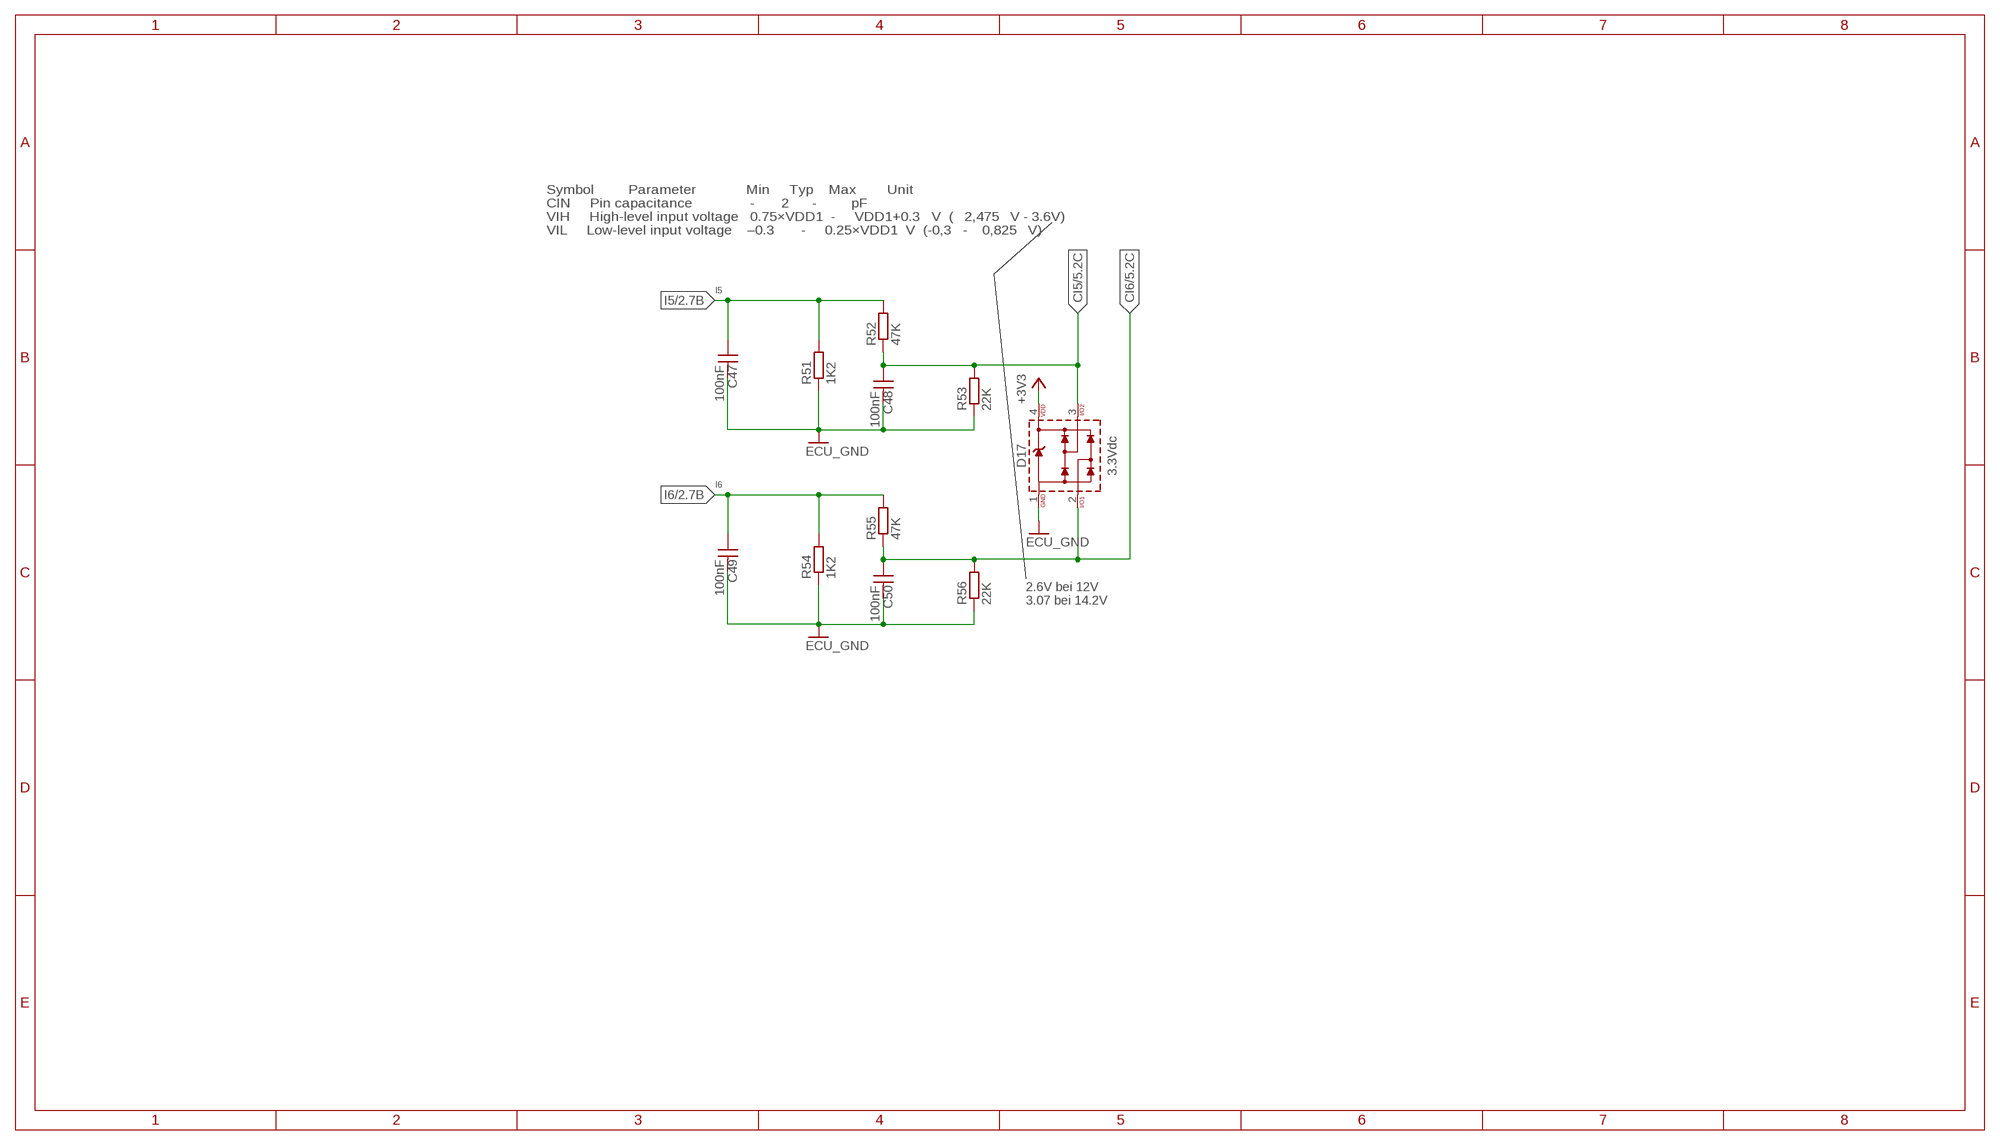
[diagram p10: schematic, sheet 11]

### Parts
C47  100nF  WCAP-CSGP_1206_H0.8_885012208087_50V(DC)  [WCAP-CSGP_1206_H0.8]
C48  100nF  WCAP-CSGP_1206_H0.8_885012208087_50V(DC)  [WCAP-CSGP_1206_H0.8]
C49  100nF  WCAP-CSGP_1206_H0.8_885012208087_50V(DC)  [WCAP-CSGP_1206_H0.8]
C50  100nF  WCAP-CSGP_1206_H0.8_885012208087_50V(DC)  [WCAP-CSGP_1206_H0.8]
D17  3.3Vdc  WE-TVS-HS_SOT143-4L_8240136  [WE-TVS_SOT143-4L]
R51  1K2  R-EU_R1206  [R1206]
R52  47K  R-EU_R1206  [R1206]
R53  22K  R-EU_R1206  [R1206]
R54  1K2  R-EU_R1206  [R1206]
R55  47K  R-EU_R1206  [R1206]
R56  22K  R-EU_R1206  [R1206]

### Nets
+3V3: D17.4(VDD) ; also sheet 4,5,6,9,10,12
CI5: C48.1 D17.3 R52.1 R53.2 ; also sheet 5,6
CI6: C50.1 D17.2 R55.1 R56.2 ; also sheet 5,6
ECU_GND [GND]: C47.2 C48.2 C49.2 C50.2 D17.1(GND) R51.1 R53.1 R54.1 R56.1 ; also sheet 2,3,4,5,6,7,8,9,10,12
I5: C47.1 R51.2 R52.2 ; also sheet 2
I6: C49.1 R54.2 R55.2 ; also sheet 2

### Notes on the sheet
- Symbol         Parameter             Min     Typ    Max        Unit
  CIN     Pin capacitance               -       2      -         pF
  VIH     High-level input voltage   0.75×VDD1  -     VDD1+0.3   V  (‭2,475‬V - 3.6V)
  VIL     Low-level input voltage    –0.3       -     0.25×VDD1  V  (-0,3   - ‭0,825‬V)
- 2.6V bei 12V
  3.07 bei 14.2V

## Sheet 12 of 12
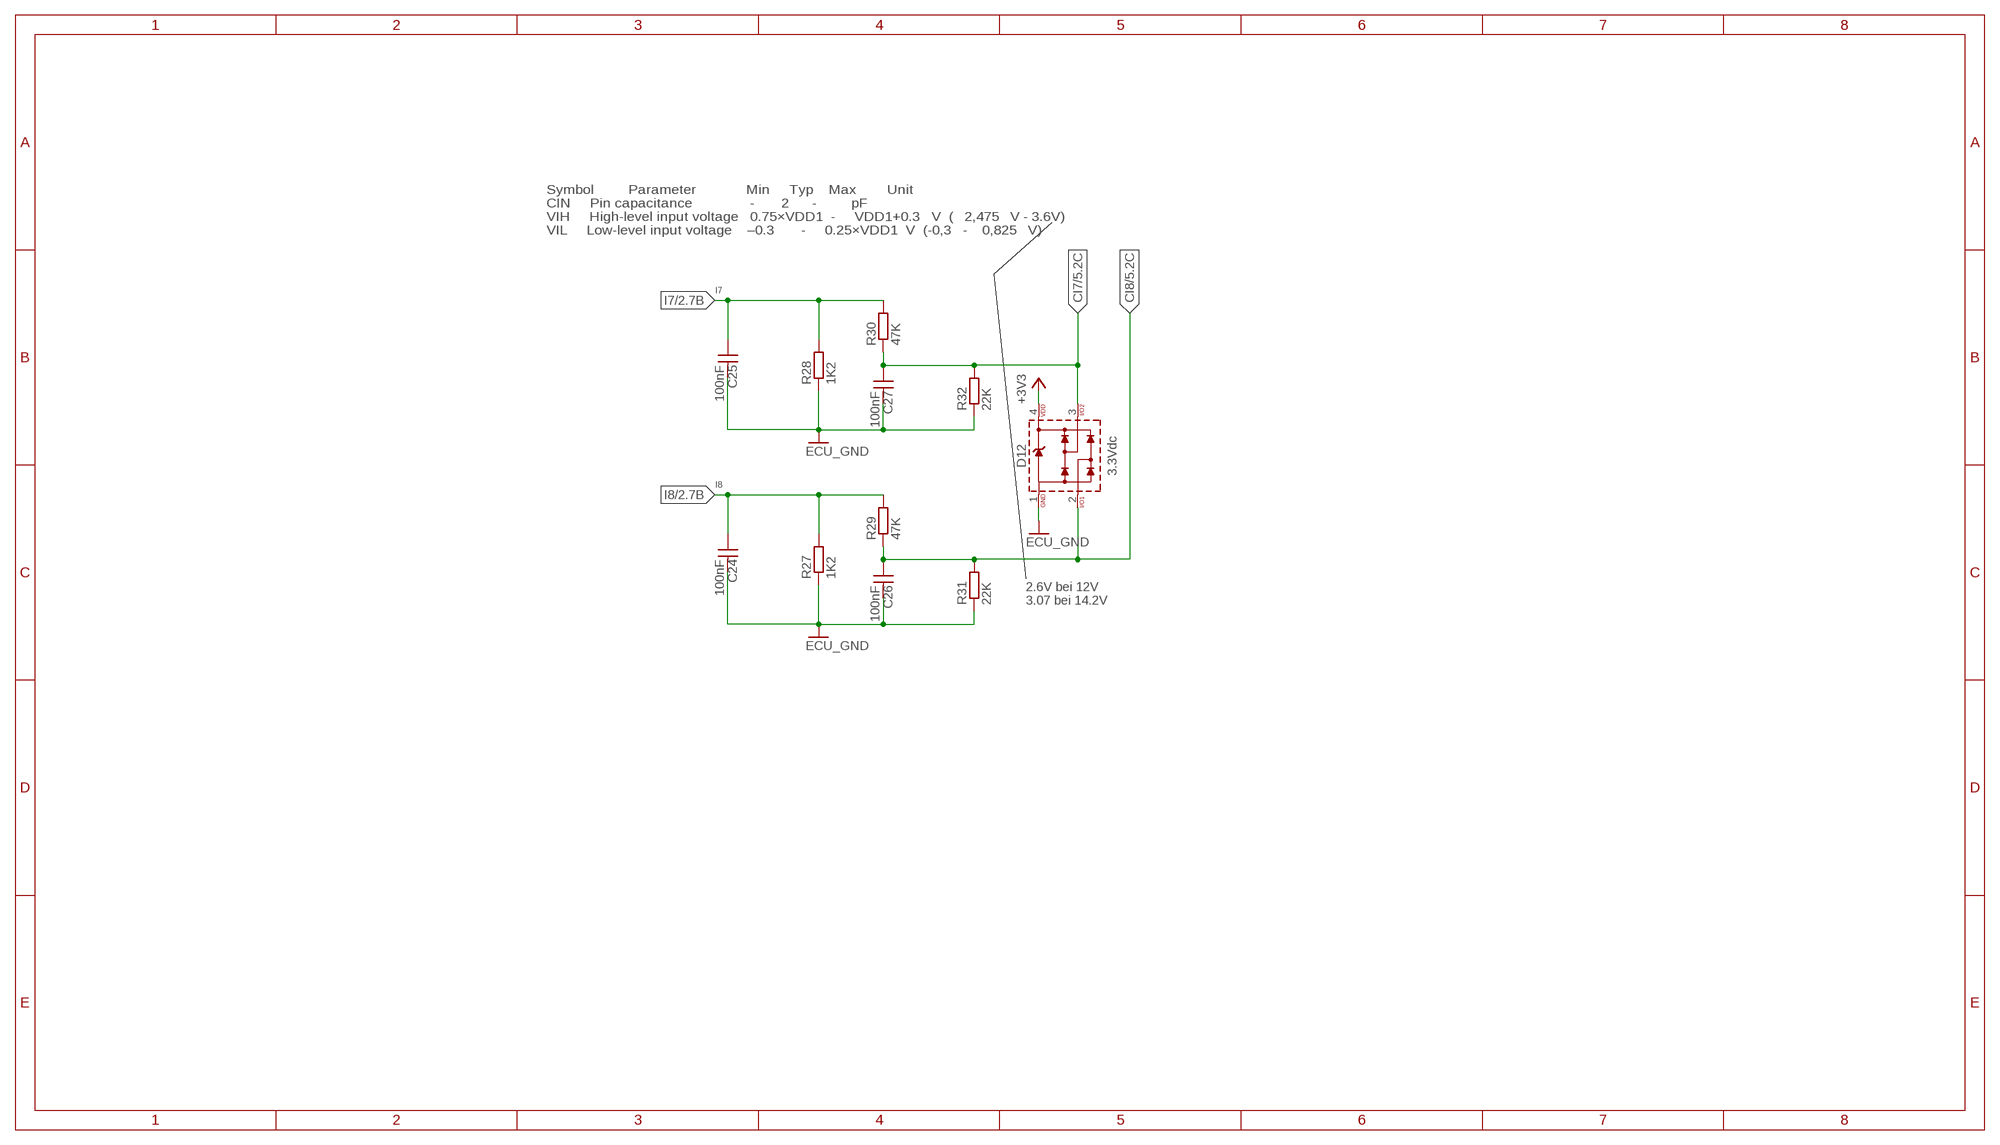
[diagram p11: schematic, sheet 12]

### Parts
C24  100nF  WCAP-CSGP_1206_H0.8_885012208087_50V(DC)  [WCAP-CSGP_1206_H0.8]
C25  100nF  WCAP-CSGP_1206_H0.8_885012208087_50V(DC)  [WCAP-CSGP_1206_H0.8]
C26  100nF  WCAP-CSGP_1206_H0.8_885012208087_50V(DC)  [WCAP-CSGP_1206_H0.8]
C27  100nF  WCAP-CSGP_1206_H0.8_885012208087_50V(DC)  [WCAP-CSGP_1206_H0.8]
D12  3.3Vdc  WE-TVS-HS_SOT143-4L_8240136  [WE-TVS_SOT143-4L]
R27  1K2  R-EU_R1206  [R1206]  (not fitted in variant 1)
R28  1K2  R-EU_R1206  [R1206]  (not fitted in variant 1)
R29  47K  R-EU_R1206  [R1206]
R30  47K  R-EU_R1206  [R1206]
R31  22K  R-EU_R1206  [R1206]
R32  22K  R-EU_R1206  [R1206]

### Nets
+3V3: D12.4(VDD) ; also sheet 4,5,6,9,10,11
CI7: C27.1 D12.3 R30.1 R32.2 ; also sheet 5,6
CI8: C26.1 D12.2 R29.1 R31.2 ; also sheet 5,6
ECU_GND [GND]: C24.2 C25.2 C26.2 C27.2 D12.1(GND) R27.1 R28.1 R31.1 R32.1 ; also sheet 2,3,4,5,6,7,8,9,10,11
I7: C25.1 R28.2 R30.2 ; also sheet 2
I8: C24.1 R27.2 R29.2 ; also sheet 2

### Notes on the sheet
- Symbol         Parameter             Min     Typ    Max        Unit
  CIN     Pin capacitance               -       2      -         pF
  VIH     High-level input voltage   0.75×VDD1  -     VDD1+0.3   V  (‭2,475‬V - 3.6V)
  VIL     Low-level input voltage    –0.3       -     0.25×VDD1  V  (-0,3   - ‭0,825‬V)
- 2.6V bei 12V
  3.07 bei 14.2V

## Library data of the parts
C1-C3 C5 C6 C13 C17-C20 = Wurth_Capacitors_WCAP-CSGP:WCAP-CSGP_0805_H0.8: WCAP-CSGP MLCCs 0805 Characteristics General purpose product series High performance ceramic High electrical precision and stability ceramic especially for NP0 Minimal aging especially for NP0 Mounting style: SMT-Chip Ceramic: NP0 (Class I), X5R (Class II), X7R (Class II) Temperature coefficient: ±30 ppm/°C; ±0.54 % for NP0 ±15 % for X5R and X7R Operating temperature: -55 °C up to + 125 °C for NP0 and X7R -55 °C up to + 85 °C for X5R Termination: Cu/Ni/Sn Recommended soldering: Reflow soldering Wave soldering for size 0603 Wave soldering for size 0805 (only valid for the thickness ≤0.85 mm) Applications Temperature compensation (NP0) Coupling Decoupling Bypass Smoothing Filtering Resonant circuit <https://www.we-online.com/catalog/media/o177837v209%20MLCC_GRP_all.jpg> Details see: https://www.we-online.com/catalog/en/pbs/capacitors/multilayer_ceramic_chip_capacitors/mlcc_general_purpose Updated by Ella Wu 2022-02-15 2022(C) Würth Elektronik; CERAMIC-TYPE: X7R Class II; DATASHEET-URL: https://www.we-online.com/redexpert/spec/885012207098?ae; DF: 2.5%; HEIGHT: 0.8mm; LENGTH: 2mm; MOUNT: SMT; OPERATING-TEMPERATURE: -55 up to +125 °C; PART-NUMBER: 885012207098; QMIN: -; RISO: 5GOhm; SIZE: 0805; VR: 50V(DC); WIDTH: 1.25mm
C4 C7-C9 C14 C16 C21 C22 = Wurth_Capacitors_WCAP-CSGP:WCAP-CSGP_0805_H0.8: WCAP-CSGP MLCCs 0805 Characteristics General purpose product series High performance ceramic High electrical precision and stability ceramic especially for NP0 Minimal aging especially for NP0 Mounting style: SMT-Chip Ceramic: NP0 (Class I), X5R (Class II), X7R (Class II) Temperature coefficient: ±30 ppm/°C; ±0.54 % for NP0 ±15 % for X5R and X7R Operating temperature: -55 °C up to + 125 °C for NP0 and X7R -55 °C up to + 85 °C for X5R Termination: Cu/Ni/Sn Recommended soldering: Reflow soldering Wave soldering for size 0603 Wave soldering for size 0805 (only valid for the thickness ≤0.85 mm) Applications Temperature compensation (NP0) Coupling Decoupling Bypass Smoothing Filtering Resonant circuit <https://www.we-online.com/catalog/media/o177837v209%20MLCC_GRP_all.jpg> Details see: https://www.we-online.com/catalog/en/pbs/capacitors/multilayer_ceramic_chip_capacitors/mlcc_general_purpose Updated by Ella Wu 2022-02-15 2022(C) Würth Elektronik; CERAMIC-TYPE: X7R Class II; DATASHEET-URL: https://www.we-online.com/redexpert/spec/885012207092?ae; DF: 2.5%; HEIGHT: 0.8mm; LENGTH: 2mm; MOUNT: SMT; OPERATING-TEMPERATURE: -55 up to +125 °C; PART-NUMBER: 885012207092; QMIN: -; RISO: 10GOhm; SIZE: 0805; VR: 50V(DC); WIDTH: 1.25mm
C10 = Wurth_Capacitors_WCAP-CSGP:WCAP-CSGP_1210_H2.5: WCAP-CSGP MLCCs 1210 Characteristics General purpose product series High performance ceramic High electrical precision and stability ceramic especially for NP0 Minimal aging especially for NP0 Mounting style: SMT-Chip Ceramic: NP0 (Class I), X5R (Class II), X7R (Class II) Temperature coefficient: ±30 ppm/°C; ±0.54 % for NP0 ±15 % for X5R and X7R Operating temperature: -55 °C up to + 125 °C for NP0 and X7R -55 °C up to + 85 °C for X5R Termination: Cu/Ni/Sn Recommended soldering: Reflow soldering Wave soldering for size 0603 Wave soldering for size 0805 (only valid for the thickness ≤0.85 mm) Applications Temperature compensation (NP0) Coupling Decoupling Bypass Smoothing Filtering Resonant circuit <https://www.we-online.com/catalog/media/o177837v209%20MLCC_GRP_all.jpg> Details see: https://www.we-online.com/catalog/en/pbs/capacitors/multilayer_ceramic_chip_capacitors/mlcc_general_purpose Updated by Ella Wu 2022-02-18 2022(C) Würth Elektronik; CERAMIC-TYPE: X5R Class II; DATASHEET-URL: https://www.we-online.com/redexpert/spec/885012109014?ae; DF: 5%; HEIGHT: 2.5mm; LENGTH: 3.2mm; MOUNT: SMT; OPERATING-TEMPERATURE: -55 up to +85 °C; PART-NUMBER: 885012109014; QMIN: -; RISO: 0.005GOhm; SIZE: 1210; VR: 25V(DC); WIDTH: 2.5mm
C12 = Wurth_Capacitors_WCAP-CSGP:WCAP-CSGP_0805_H1.25: WCAP-CSGP MLCCs 0805 General Purpose Characteristics General purpose product series High performance ceramic High electrical precision and stability ceramic especially for NP0 Minimal aging especially for NP0 Mounting style: SMT-Chip Ceramic: NP0 (Class I), X5R (Class II), X7R (Class II) Temperature coefficient: ±30 ppm/°C; ±0.54 % for NP0 ±15 % for X5R and X7R Operating temperature: -55 °C up to + 125 °C for NP0 and X7R -55 °C up to + 85 °C for X5R Termination: Cu/Ni/Sn Recommended soldering: Reflow soldering Wave soldering for size 0603 Wave soldering for size 0805 (only valid for the thickness ≤0.85 mm) Applications Temperature compensation (NP0) Coupling Decoupling Bypass Smoothing Filtering Resonant circuit <https://www.we-online.com/catalog/media/o177837v209%20MLCC_GRP_all.jpg> Details see: https://www.we-online.com/catalog/en/pbs/capacitors/multilayer_ceramic_chip_capacitors/mlcc_general_purpose Updated by Ella Wu 2024-01-18 2024(C) Würth Elektronik; CERAMIC-TYPE: X5R Class II; DATASHEET-URL: https://www.we-online.com/redexpert/spec/885012107011?ae; DF: 10%; HEIGHT: 1.25mm; LENGTH: 2mm; MOUNT: SMT; OPERATING-TEMPERATURE: -55 up to +85 °C; PART-NUMBER: 885012107011; QMIN: -; RISO: 0.005GOhm; SIZE: 0805; VR: 10V(DC); WIDTH: 1.25mm
C15 = Wurth_Capacitors_WCAP-CSGP:WCAP-CSGP_0805_H0.8: WCAP-CSGP MLCCs 0805 Characteristics General purpose product series High performance ceramic High electrical precision and stability ceramic especially for NP0 Minimal aging especially for NP0 Mounting style: SMT-Chip Ceramic: NP0 (Class I), X5R (Class II), X7R (Class II) Temperature coefficient: ±30 ppm/°C; ±0.54 % for NP0 ±15 % for X5R and X7R Operating temperature: -55 °C up to + 125 °C for NP0 and X7R -55 °C up to + 85 °C for X5R Termination: Cu/Ni/Sn Recommended soldering: Reflow soldering Wave soldering for size 0603 Wave soldering for size 0805 (only valid for the thickness ≤0.85 mm) Applications Temperature compensation (NP0) Coupling Decoupling Bypass Smoothing Filtering Resonant circuit <https://www.we-online.com/catalog/media/o177837v209%20MLCC_GRP_all.jpg> Details see: https://www.we-online.com/catalog/en/pbs/capacitors/multilayer_ceramic_chip_capacitors/mlcc_general_purpose Updated by Ella Wu 2022-02-15 2022(C) Würth Elektronik; CERAMIC-TYPE: X7R Class II; DATASHEET-URL: https://www.we-online.com/redexpert/spec/885012207096?ae; DF: 2.5%; HEIGHT: 0.8mm; LENGTH: 2mm; MOUNT: SMT; OPERATING-TEMPERATURE: -55 up to +125 °C; PART-NUMBER: 885012207096; QMIN: -; RISO: 10GOhm; SIZE: 0805; VR: 50V(DC); WIDTH: 1.25mm
C23 = Wurth_Capacitors_WCAP-ASLI:WCAP-ASLI_12.5X14: WCAP-ASLI Aluminium Electrolytic Capacitors Low Impedance +105 °C Characteristics Low impedance product series Mounting style: V-Chip SMT Capacitance range: 0.1 µF ‒ 6800 µF Capacitance tolerance: ±20 % Voltage range (UR): 6.3 ‒ 100 V(DC) Operating temperature: -55 °C up to +105 °C Endurance: 2000 h @ +105 °C Dimensions (DxL) in mm: 4.0 x 5.5 up to 16.0 x 17.0 Recommended soldering: Reflow soldering Applications Low impedance, especially for filtering applications Input and output capacitor for switched-mode power supply Filtering Smoothing e.g. DC/DC converter, AC/DC converter, satellite receiver, control panel <https://www.we-online.com/catalog/media/o14723v209%20Family_WCAP-ASLI.jpg> Details see: https://www.we-online.com/catalog/en/WCAP-ASLI/ Updated by yingchun,Shan;2020-03-03 2020(C) Würth Elektronik; DATASHEET-URL: https://www.we-online.com/catalog/datasheet/865080662019.pdf; DF: 12%; DIAMETER: 12.5mm; I-LEAK: 165uA; I-RIPPLE: 800mA; L: 14mm; OPERATING-TEMPERATURE: -55 °C up to +105 °C; PART-NUMBER: 865080662019; TECHNICAL-REFERENCE: ASEH140331M050DVCTGB000; VR: 50V(DC)
C24-C27 C31-C34 C39-C42 C47-C50 = Wurth_Capacitors_WCAP-CSGP:WCAP-CSGP_1206_H0.8: WCAP-CSGP MLCCs 1206 Characteristics General purpose product series High performance ceramic High electrical precision and stability ceramic especially for NP0 Minimal aging especially for NP0 Mounting style: SMT-Chip Ceramic: NP0 (Class I), X5R (Class II), X7R (Class II) Temperature coefficient: ±30 ppm/°C; ±0.54 % for NP0 ±15 % for X5R and X7R Operating temperature: -55 °C up to + 125 °C for NP0 and X7R -55 °C up to + 85 °C for X5R Termination: Cu/Ni/Sn Recommended soldering: Reflow soldering Wave soldering for size 0603 Wave soldering for size 0805 (only valid for the thickness ≤0.85 mm) Applications Temperature compensation (NP0) Coupling Decoupling Bypass Smoothing Filtering Resonant circuit <https://www.we-online.com/catalog/media/o177837v209%20MLCC_GRP_all.jpg> Details see: https://www.we-online.com/catalog/en/pbs/capacitors/multilayer_ceramic_chip_capacitors/mlcc_general_purpose Updated by yingchun,Shan;2020-03-09 2020(C) Würth Elektronik; CERAMIC-TYPE: X7R Class II; DATASHEET-URL: https://www.we-online.com/redexpert/spec/885012208087?ae; DF: 2.5%; HEIGHT: 0.8mm; LENGTH: 3.2mm; MOUNT: SMT; OPERATING-TEMPERATURE: -55 up to +125 °C; PART-NUMBER: 885012208087; QMIN: -; RISO: 5GOhm; SIZE: 1206; VR: 50V(DC); WIDTH: 1.6mm
D0 D5 = Wurth_EMC Components_WE-TVSP:WE-TVSP_DO-214AB_3000W_BI: WE-TVSP Power TVS Diode Characteristics Low Profile Package Glass passivated Juction Excellent clamping capability Fast response time MSL Level 1, per J-STD-020 Classification of the plastic case: UL 94 V-0 Safety certification UL 497B, E478010 Identical design: - DO-214AC = SMAJ - DO-214AA = SMBJ - DO-214AB = SMCJ/SMDJ Applications Ideal to protect the I/O Interfaces, Bus Voltage and other circuits of sensetive electronic equipment against voltage transiensts <https://www.we-online.com/catalog/media/o55793v209%20WE-TVSP_600W-3000W_D0214AA_4C.jpg> Details see: https://www.we-online.com/catalog/en/WE-TVSP/ Updated by Ella Wu 2020-07-20 2020 (C) Würth Elektronik; DATASHEET-URL: https://www.we-online.com/catalog/datasheet/824551331.pdf; IPEAK: 56.3A; MOUNT: SMT; PART-NUMBER: 824551331; PDISS: 3000W; VBR: 38.65V; VCLAMP: 53.3V
D1-D4 D7-D10 = Wurth_LEDs_WL-SMTW:WL-SMTW_3528: WL-SMTW SMT Mono-color TOP LED Waterclear Characteristics Low energy consumption High reliability Low current requirement Fast switching No UV/IR radiation Slim Miniature size Flexibility in design Top view LED PLCC 2 white package Compact package outline, ideal for miniature applications Variety of colors Applications Signage and indirect illumination Flat lamp Indicator and backlight in telecommunication Consumer application: dash-board, telephone or A/V equipments Flat backlight for LCDs, switches and symbols Optical indicators Indoor and outdoor displays Scanner Backlight in LCD, cellular phones, switches, keys, displays lluminated advertising, panel Lighting device: indicator, general lighting Camera flash, hand carrier flash Coupling into light guides <https://www.we-online.com/catalog/media/o14908v209%20WL-SMTW_150285BSxxx.jpg> Details see: www.we-online.com/catalog/WL-SMTW <www.we-online.com/catalog/WL-SMTW/?utm_source=eagle_model&utm_medium=description_link&utm_campaign=eisos_eagle> Updated by Ella 2022-06-21 2022(C) Wurth Elektronik; CHIP-TECHNOLOGY: AlInGaP; DATASHEET-URL: https://www.we-online.com/redexpert/spec/150141VS73100?ae; DOMINANT-WAVELENGTH: 570nm; EMITTING-COLOR: Bright Green; FORWARD-VOLTAGE: 2V; LUMINOUS-INTENSITY: 90mcd; MOUNT: SMT; PART-NUMBER: 150141VS73100; PEAK-WAVELENGTH: 572nm; VIEWING-ANGLE: 120°
D006 = fliegl-elektronik:MBRS3*0T3: SCHOTTKY BARRIER RECTIFIER 3.0 AMPERES 20, 30, 40 VOLT Source: MBRS340T3-D.pdf; ARTIKEL_NR: 513891
D11 = Wurth_EMC Components_WE-TVS:WE-TVS_SOT23-3L_824094024: WE-TVS TVS Diode – Standard Series Characteristics Fast turn-on Low clamping voltage High ESD withstand voltage Uni- or bidirectional protection Small package Epoxy flame resistant UL94 V-0 Applications DC power supply USB Power Delivery (PD) Headsets and accessories PDAs Digital cameras MP3-Player Touch Panels Notebooks ESD, EFT and Surge Protection ESD protection in accordance with EN 61000-4-2 – 8 kV contact discharge – 15 kV air discharge <https://www.we-online.com/catalog/media/o106433v209%20Family_WE-TVS_Standard.jpg> Details see: https://www.we-online.com/catalog/en/WE-TVS Created by Ella Wu 2021-12-15 2021 (C) Wurth Elektronik; C-CH: 38pF; CHANNELS: 2; DATASHEET-URL: https://www.we-online.com/catalog/datasheet/824094024.pdf; IPEAK: 6A; MOUNT: SMT; PART-NUMBER: 824094024; VBR: 26.2V
D12 D13 D15 D17 = Wurth_EMC Components_WE-TVS:WE-TVS-HS_SOT143-4L_8240136: WE-TVS TVS Diode – High Speed Series Characteristics Low clamping voltage Sturdy design Very low capacitance Flow Thru Design for a simple layout Rail to Rail protection Epoxy flame resistant UL94-V0 RoHS, REACH and free of halogens Applications Very fast data lines USB 2.0 Ethernet PoE VGA Sim Cards Keypads HS = High Speed <https://www.we-online.com/catalog/media/o14883v209%20Family_WE-TVS_HIGHSPEED.jpg> Details see: https://www.we-online.com/catalog/en/WE-TVS-HS Updated by Ella Wu 2019-07-12 2019 (C) Wurth Elektronik; C-CH: 3pF; CHANNELS: 2+1; DATASHEET-URL: https://www.we-online.com/catalog/datasheet/8240136.pdf; IPEAK: 12A; MOUNT: SMT; PART-NUMBER: 8240136; VBR: 4.5V
D014 D016 D018-D023 = fliegl-elektronik:GS1*-L: 1.0 Amp Glass Passivated Rectifier 50 to 1000 Volts Datenblatt <http://www.mouser.com/ds/2/258/GS1A-L~GS1M-L(DO-214AC)-257344.pdf>; ARTIKEL_NR: 502724; OC: Farnell 1924364
ESP32-J1 ESP32-J3 = Wurth_Connectors_WR-PHD:6130XX11821_61302211821: WR-PHD 2.54 mm Socket Header Article Properties Pins 2 unitless; 3 unitless; 4 unitless; 5 unitless; 6 unitless; 7 unitless; 8 unitless; 9 unitless; 10 unitless; 12 unitless; 13 unitless; 14 unitless; 15 unitless; 16 unitless; 18 unitless; 20 unitless; 22 unitless; 24 unitless; 32 unitless; 36 unitless; 40 unitless General Information Operating Temperature -40 °C up to +105 °C Pitch 2.54 mm Durability 25 Mating cycles; 500 Mating cycles Rows Single Gender Socket Header Type Straight Material Properties Insulator Material PBT Insulator Flammability Rating UL94 V-0 Contact Material Copper Alloy Contact Plating Gold Contact Type Stamped Certification UL Approval E323964 Packaging Properties Packaging Tray Electrical Properties Withstanding Voltage 500 V (AC) Contact Resistance 20 mΩ RISO 1000 MΩ <https://www.we-online.com/components/media/o33218v209%20Family_WR-PHD_613xxx11821.jpg> Details see: www.we-online.com/en/components/products/PHD_2_54_SOCKET_HEADER_6130XX11821 <www.we-online.com/catalog/PHD_2_54_SOCKET_HEADER_6130XX11821/?utm_source=eagle_model&utm_medium=description_link&utm_campaign=eisos_eagle> Updated by Yingchun,Shan 2019-10-21 2019 (C) Würth Elektronik; DATASHEET-URL: https://www.we-online.com/redexpert/spec/61302211821?ae; GENDER: Socket Header; IR: 3A; MOUNT: THT; PACKAGING: Tray; PART-NUMBER: 61302211821; PINS: 22; PITCH: 2.54mm; ROWS: Single; TYPE: Straight
G1 = IFX27001TF V50:IFX27001TF_V50: IFX27001TF V50 INF-PG-TO252-3-11_N Linear Voltage Regulator, 4.7 to 40 V Supply, Fixed/Adjustable Output, -40 to 125 degC, PG-TO252-3, Reel, Green
J1 J7 J13 = Wurth_Connectors_WR-FAST:638207222005: WR-FAST 5.08 mm THT Male Header Vertical Blade 2863 KIND PROPERTIES Pitch 5.08 mm Gender Male MATERIAL PROPERTIES Insulator Material PC Insulator Flammability Rating UL94 V-0 Insulator Color Black Contact Material Steel Contact Plating Tin Contact Type Stamped GENERAL INFORMATION Operating Temperature -30 up to +120 °C Working Voltage 300 V (AC) Withstanding Voltage 1600 V (AC) Contact Resistance 20 mΩ RISO 5 MΩ IR 16 A CERTIFICATION cULus Approval E150931 PACKAGING PROPERTIES Packaging Box <https://www.we-online.com/catalog/media/o165124v209%20Family_ConFAST_638207222004.jpg> Details see: https://www.we-online.com/catalog/en/FAST_5_08_THT_MALE_VERTICAL_6382072220XX/ Updated by Ella Wu 2020-08-11 2020(C) Wurth Elektronik; CONTACT-RESISTANCE: 20mOhm; DATASHEET-URL: https://www.we-online.com/catalog/datasheet/638207222005.pdf; GENDER: Male; IR: 16A; MOUNT: THT; PART-NUMBER: 638207222005; PINS: 5; PITCH: 5.08mm; TYPE: Vertical; WORKING-VOLTAGE: 300V(AC)
J2 = Wurth_Connectors_WR-WTB:645004114822: WR-WTB 3.96 mm Male Vertical Locking Header KIND PROPERTIES: Pitch:3.96mm Gender:Male MATERIAL PROPERTIES: Insulator Material :PA66 Insulator Flammability Rating:UL94 V-2 Color:White Contact Material:Copper Alloy Contact Plating:Tin Contact Type:Stamped GENERAL INFORMATION Operating Temperature:-40 up to +105 °C Compliance: RoHS Working Voltage:250 V (AC) Withstanding Voltage:1500 V (AC) Contact Resistance:20 mΩ RISO:1000 MΩ CERTIFICATION UL Approval:E323964 PACKAGING PROPERTIES Packaging:Bag <https://katalog.we-online.com/media/images/v2/o33361v209%20Family_WR-WTB_6450xx114822.jpg> Details see: https://katalog.we-online.com/en/em/WTB_3_96_MALE_LOCKING_HEADER_6450XX114822 Updated by Yingchun,Shan 2019-11-05 2019 (C) Würth Elektronik; CONTACT-RESISTANCE: 20mOhm; DATASHEET-URL: https://www.we-online.com/redexpert/spec/645004114822?ae; GENDER: Male; IR: 7A; L: 15.84mm; MOUNT: THT; PACKAGING: Bag; PART-NUMBER: 645004114822; PCB-CABLE-PANEL: PCB; PINS: 4; PITCH: 3.96mm; TYPE: Vertical; WORKING-VOLTAGE: 250V(AC)
J4 = Wurth_Connectors_WR-PHD:6130XX21121_61300421121: WR-PHD 2.54 mm THT Dual Pin Header ARTICLE PROPERTIES: Pins:4;​ 6;​ 8;​ 10;​ 12;​ 14;​ 16;​ 18;​ 20;​ 22;​ 24;​ 26;​ 28;​ 30;​ 32;​ 34;​ 36;​ 40;​ 44;​ 64;​ 72;​ 80 KIND PROPERTIES: Pitch：2.54 mm Quality Class:3 as per CECC 75 301-802 Rows：Dual Gender：Pin Header Type：Board Stacker MATERIAL PROPERTIES: Insulator Material :PA6T Insulator Flammability Rating:UL94 V-0 Contact Material:Copper Alloy Contact Plating:Gold Contact Type:Stamped GENERAL INFORMATION Operating Temperature:-40 up to +105 °C Compliance:Lead free / RoHS ELECTRICAL PROPERTIES: Rated Current:3 A IR 1:3 A Withstanding Voltage:500 V (AC) Contact Resistance:20 mΩ RISO:1000 MΩ CERTIFICATION UL Approval:E323964 PACKAGING PROPERTIES Packaging:Bag <https://katalog.we-online.com/media/images/v2/o33215v209%20Family_WR-PHD_6130xx21121.jpg> Details see: https://katalog.we-online.com/en/em/PHD_2_54_THT_DUAL_PIN_HEADER_6130XX21121 Updated by Yingchun,Shan 2019-10-16 2019 (C) Würth Elektronik; DATASHEET-URL: https://www.we-online.com/redexpert/spec/61300421121?ae; GENDER: Pin Header; IR: 3A; MOUNT: THT; PACKAGING: Bag; PART-NUMBER: 61300421121; PINS: 4; PITCH: 2.54mm; ROWS: Dual; TYPE: Board Stacker
J5 J9 = 6-pin-tht:6130XX21121_61300621121: WR-PHD 2.54 mm THT Dual Pin Header ARTICLE PROPERTIES: Pins:4;​ 6;​ 8;​ 10;​ 12;​ 14;​ 16;​ 18;​ 20;​ 22;​ 24;​ 26;​ 28;​ 30;​ 32;​ 34;​ 36;​ 40;​ 44;​ 64;​ 72;​ 80 KIND PROPERTIES: Pitch：2.54 mm Quality Class:3 as per CECC 75 301-802 Rows：Dual Gender：Pin Header Type：Board Stacker MATERIAL PROPERTIES: Insulator Material :PA6T Insulator Flammability Rating:UL94 V-0 Contact Material:Copper Alloy Contact Plating:Gold Contact Type:Stamped GENERAL INFORMATION Operating Temperature:-40 up to +105 °C Compliance:Lead free / RoHS ELECTRICAL PROPERTIES: Rated Current:3 A IR 1:3 A Withstanding Voltage:500 V (AC) Contact Resistance:20 mΩ RISO:1000 MΩ CERTIFICATION UL Approval:E323964 PACKAGING PROPERTIES Packaging:Bag <https://katalog.we-online.com/media/images/v2/o33215v209%20Family_WR-PHD_6130xx21121.jpg> Details see: https://katalog.we-online.com/en/em/PHD_2_54_THT_DUAL_PIN_HEADER_6130XX21121 Updated by Yingchun,Shan 2019-10-16 2019 (C) Würth Elektronik; DATASHEET-URL: https://katalog.we-online.com/em/datasheet/61300621121.pdf; GENDER: Pin Header; IR: 3A; MATES: WR-PHD 2.54mm Angled DualSocket Header/Dual Socket Header/Dual Socket Header Bottom Entry/Dual Socket Header Bottom Entry Large/SMT Dual Socket Header/SMT Dual Socket Header Bottom Entry; PACKAGING: Bag; PART-NUMBER: 61300621121; PINS: 6; ROWS: Dual; TYPE: Board Stacker
J8 = Wurth_Connectors_WR-FAST:638207222007: WR-FAST 5.08 mm THT Male Header Vertical Blade 2863 KIND PROPERTIES Pitch 5.08 mm Gender Male MATERIAL PROPERTIES Insulator Material PC Insulator Flammability Rating UL94 V-0 Insulator Color Black Contact Material Steel Contact Plating Tin Contact Type Stamped GENERAL INFORMATION Operating Temperature -30 up to +120 °C Working Voltage 300 V (AC) Withstanding Voltage 1600 V (AC) Contact Resistance 20 mΩ RISO 5 MΩ IR 16 A CERTIFICATION cULus Approval E150931 PACKAGING PROPERTIES Packaging Box <https://www.we-online.com/catalog/media/o165124v209%20Family_ConFAST_638207222004.jpg> Details see: https://www.we-online.com/catalog/en/FAST_5_08_THT_MALE_VERTICAL_6382072220XX/ Updated by Ella Wu 2020-08-11 2020(C) Wurth Elektronik; CONTACT-RESISTANCE: 20mOhm; DATASHEET-URL: https://www.we-online.com/catalog/datasheet/638207222007.pdf; GENDER: Male; IR: 16A; MOUNT: THT; PART-NUMBER: 638207222007; PINS: 7; PITCH: 5.08mm; TYPE: Vertical; WORKING-VOLTAGE: 300V(AC)
J15 = Wurth_Connectors_WR-FAST:638207222008: WR-FAST 5.08 mm THT Male Header Vertical Blade 2863 KIND PROPERTIES Pitch 5.08 mm Gender Male MATERIAL PROPERTIES Insulator Material PC Insulator Flammability Rating UL94 V-0 Insulator Color Black Contact Material Steel Contact Plating Tin Contact Type Stamped GENERAL INFORMATION Operating Temperature -30 up to +120 °C Working Voltage 300 V (AC) Withstanding Voltage 1600 V (AC) Contact Resistance 20 mΩ RISO 5 MΩ IR 16 A CERTIFICATION cULus Approval E150931 PACKAGING PROPERTIES Packaging Box <https://www.we-online.com/catalog/media/o165124v209%20Family_ConFAST_638207222004.jpg> Details see: https://www.we-online.com/catalog/en/FAST_5_08_THT_MALE_VERTICAL_6382072220XX/ Updated by Ella Wu 2020-08-11 2020(C) Wurth Elektronik; CONTACT-RESISTANCE: 20mOhm; DATASHEET-URL: https://www.we-online.com/catalog/datasheet/638207222008.pdf; GENDER: Male; IR: 16A; MOUNT: THT; PART-NUMBER: 638207222008; PINS: 8; PITCH: 5.08mm; TYPE: Vertical; WORKING-VOLTAGE: 300V(AC)
R1-R44 R51-R56 RX1-RX8 = resistor:R-EU_: RESISTOR, European symbol
RESET = Wurth_Switch_WS-TATU:431256083736: WS-TATV THT Tact Switch 6x6 mm Material Properties Cover Material : Carbon Steel Properties Actuator Material:LCP Actuator Flammability Rating:UL94 V-0 Actuator Color:Black; Salmon; White Frame Material:PPA Frame Flammability Rating:UL94 HB Frame Color:Black Contact Material:Stainless Steel Contact Plating:Silver Terminal Material:Copper Alloy Terminal Plating:Silver VR:12 V (DC) Contact Resistance Initial:100 mΩ Contact Resistance After Life Test:2 Ω RISO:100 MΩ Withstanding Voltage:250 V (AC) Qty.:500 Mechanical Properties Stroke 0.25 mm General Information Operating Temperature:-40 up to +85 °C Packaging Properties Packaging:Bulk <https://www.we-online.com/catalog/media/o61137v209%20Family_WS_TST_THT_4312560xx7x6_pf2.jpg> Details see: https://www.we-online.com/catalog/en/TATU_6X6_THT_RIGHT_ANGLED_WITH_GROUND_TERMINAL/ Updated by yingchun,Shan;2020-02-21 2020(C) Würth Elektronik; DATASHEET-URL: https://www.we-online.com/catalog/datasheet/431256083736.pdf; H: 8.35mm; OPERATION-FORCE: 360g; PART-NUMBER: 431256083736; QTY: 500
U2 U3 U5 U6 = BTS7030-2EPA:BTS7030-2EPA: BTS7030-2EPA PROFET +2, Smart High-Side Power Switch 30 mOhm Dual Channel SOP65P600X115-15N-V
U4 = TLE9250VSJ:TLE9250VSJ: TLE9250VSJ SOIC127P602X173-8N-V High Speed CAN FD Transceiver; ARTIKEL_NR: 545599

## Net classes
1 GND: width 0.127 mm, clearance 0.127 mm to class 0
2 Ampere7: width 3 mm, drill 0.3 mm, clearance 0.3 mm

## Board
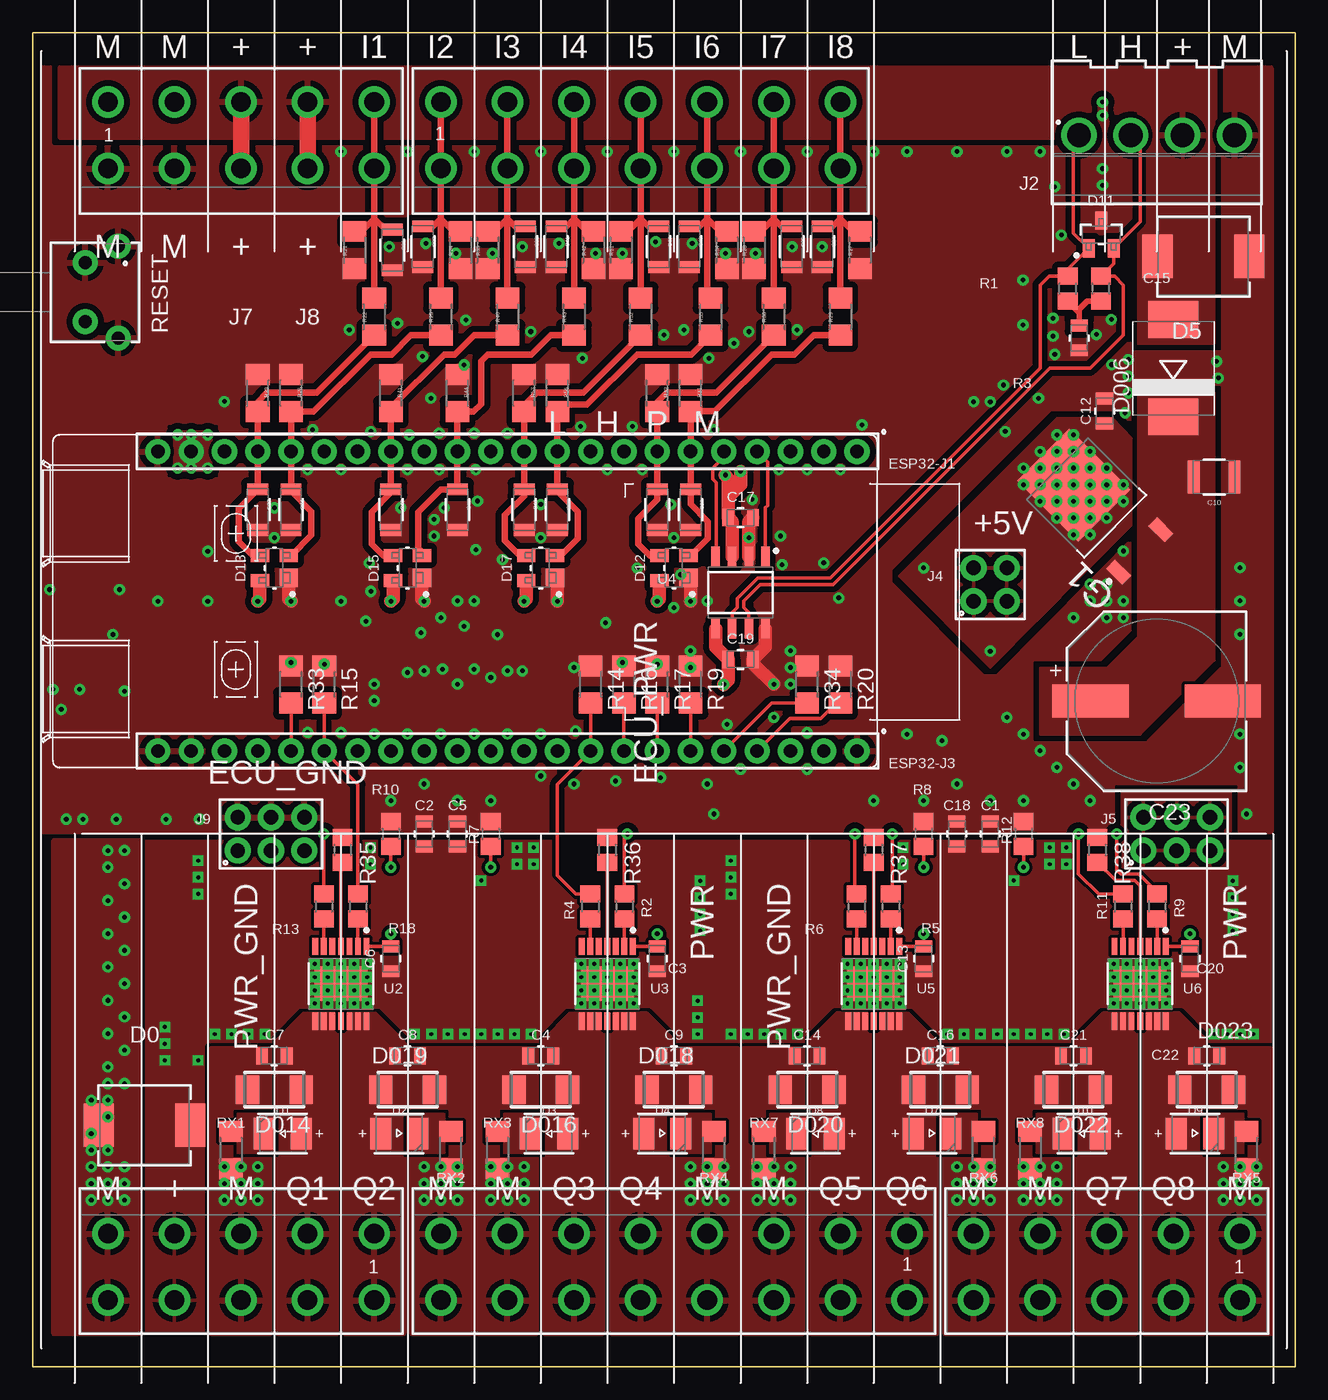
[diagram p12: board, top side]
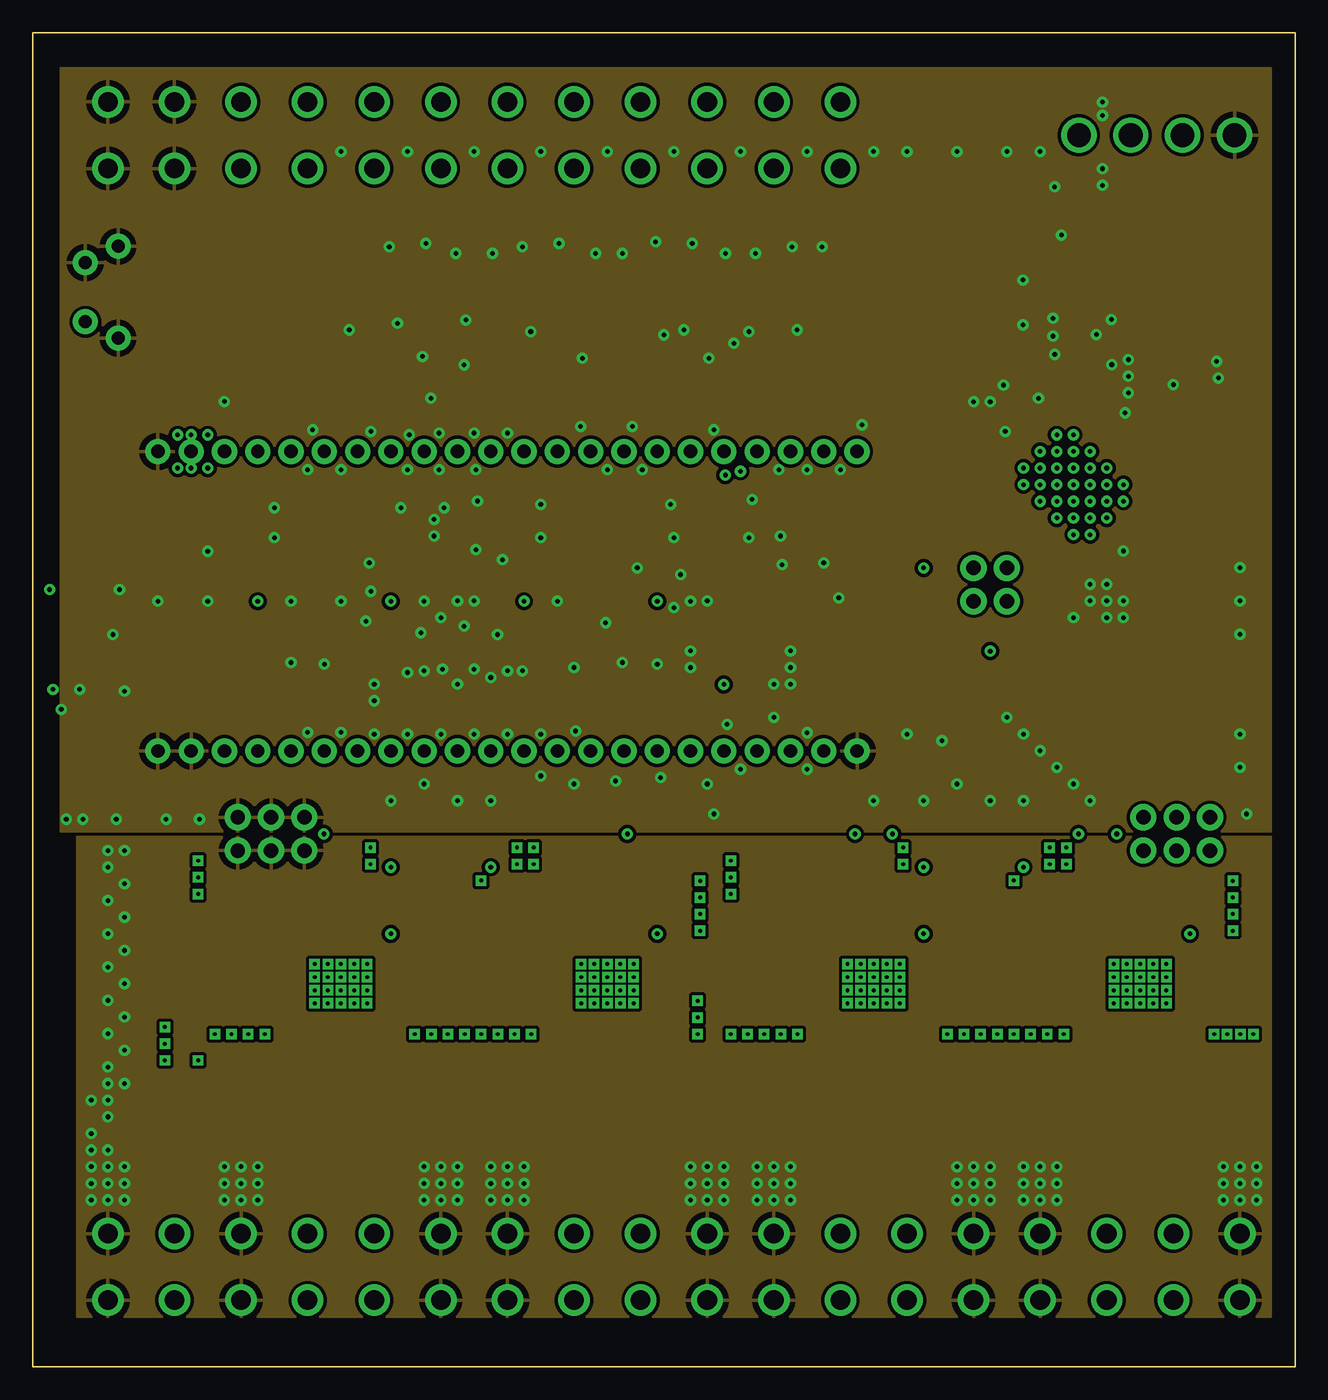
[diagram p13: board, inner layer Route2]
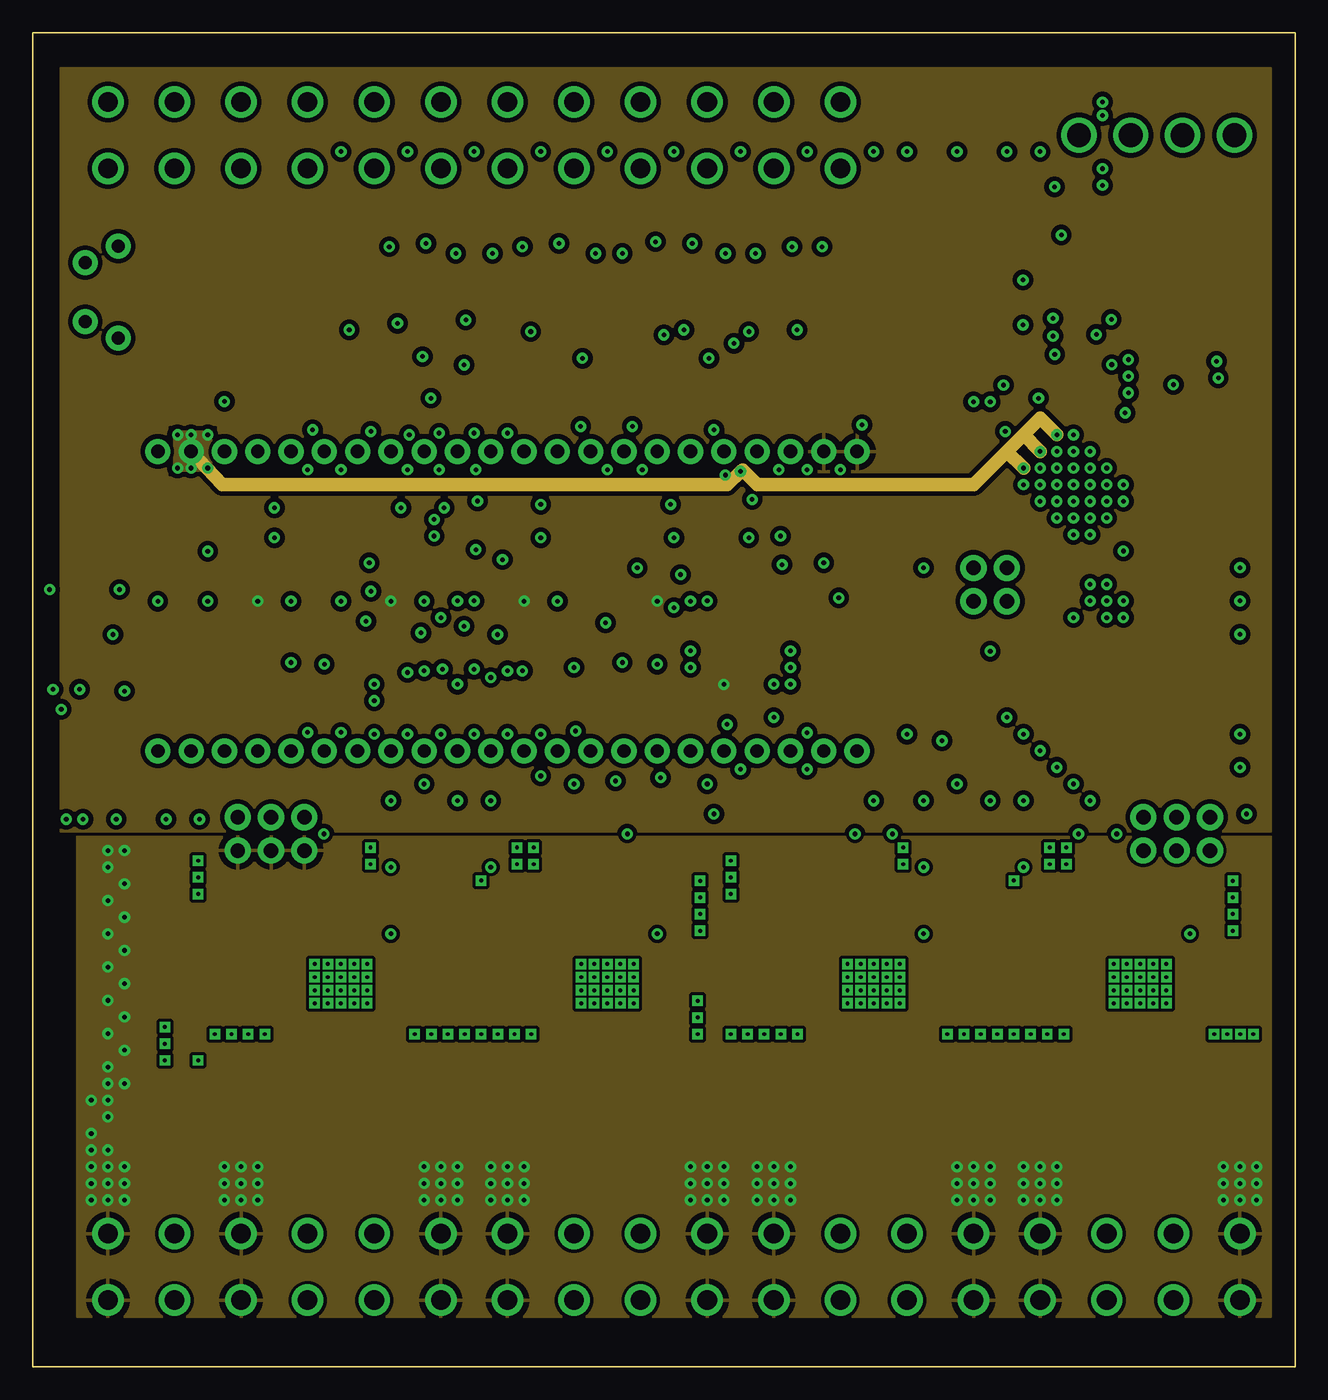
[diagram p14: board, inner layer Route15]
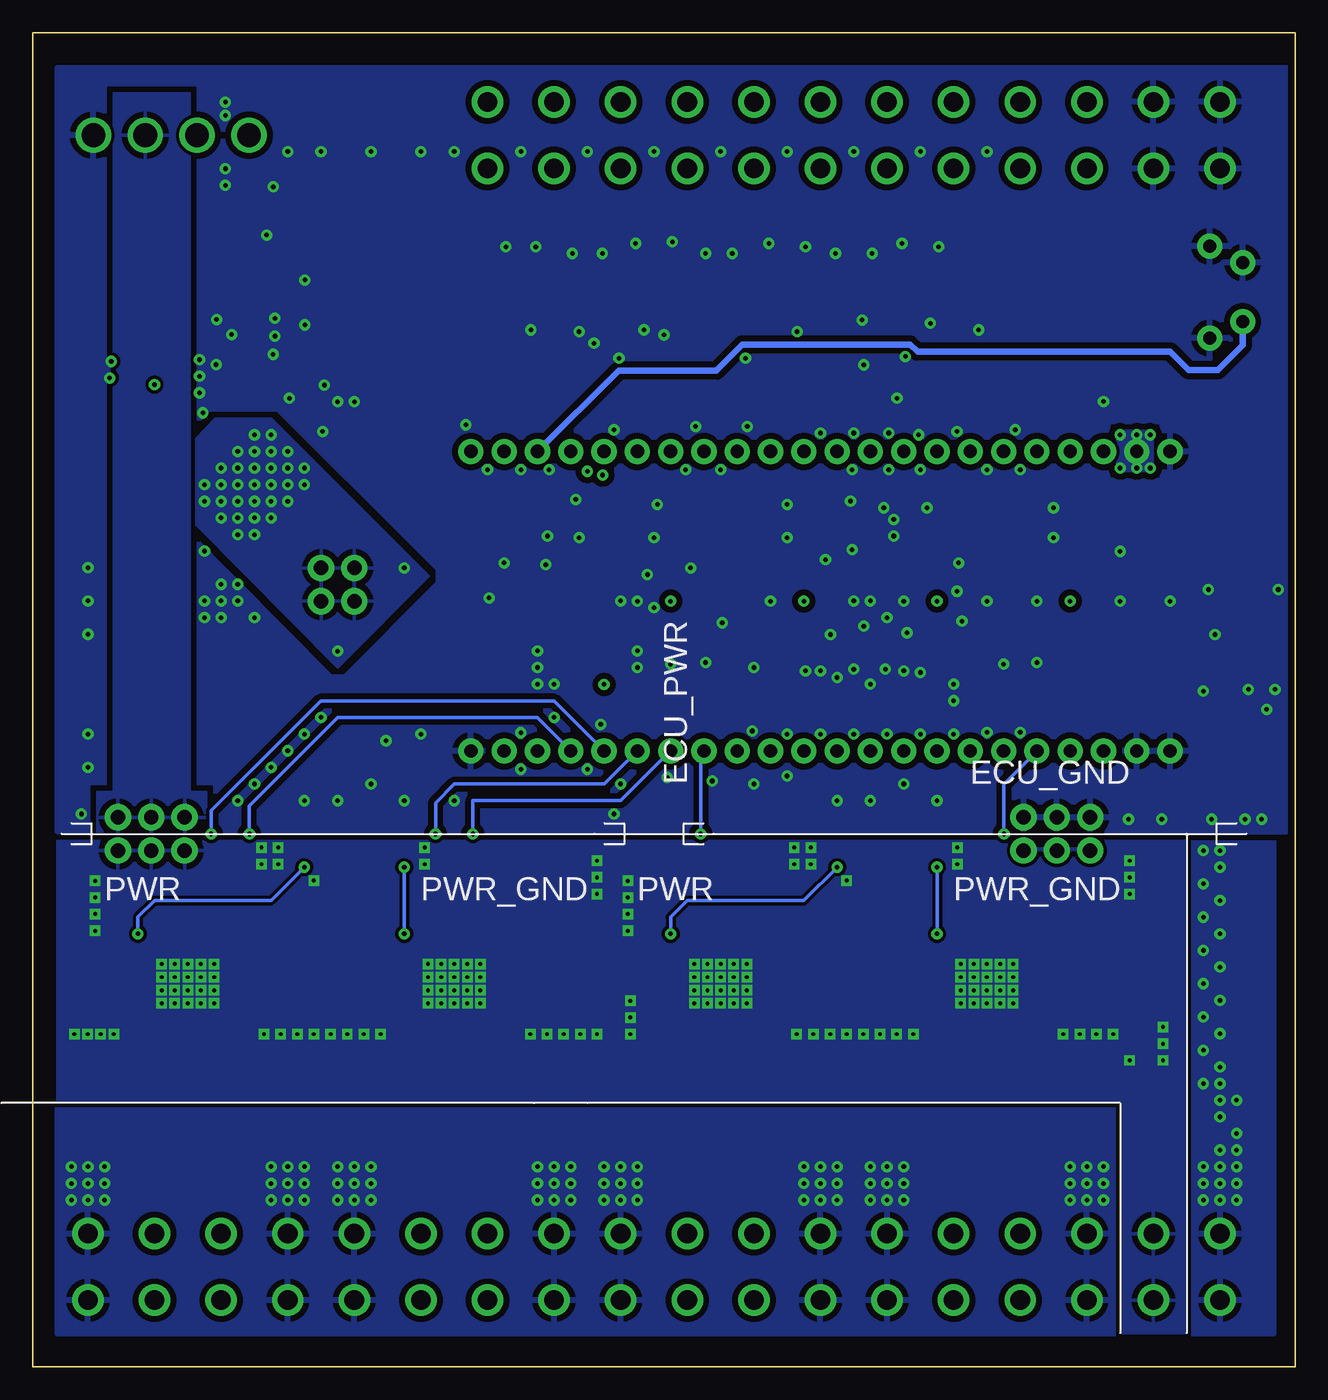
[diagram p15: board, bottom side, seen from below]

Size 96.3 x 101.8 mm. Coordinates in mm from the lower left corner, seen from the top.
Outline: 0,101.8 0,0 96.3,0 96.3,101.8 0,101.8
Copper layers (1+2*15+16): Top 0.07mm / dielectric 0.36mm / Route2 0.035mm / dielectric 0.71mm / Route15 0.035mm / dielectric 0.2mm / Bottom 0.07mm
Design rules "Multi-CB_4L_250µm-Tracks_OL105µm-IL35µm *": minimum track width 0.25mm, minimum drill 0.2mm, track to track 0.25mm, track to pad 0.25mm, pad to pad 0.2mm, via to via 0.25mm, smd to smd 0mil, copper to edge 0.5mm, drill to drill 0.5mm, minimum pad ring 0.45mm, minimum via ring 0.25mm, stop-mask expansion 2mil, vias tented up to drill 0.45mm, thermal gap 0.45mm
tKeepout: area 51.9,39.9 to 52.7,41.5; area 4.5,39.9 to 5.3,41.5; area 92.5,39.9 to 93.3,41.5; area 45.1,39.9 to 45.9,41.5
bKeepout: area 4.5,39.9 to 6,41.5; area 51.2,39.9 to 52.7,41.5; area 45.1,39.9 to 46.6,41.5; area 91.8,39.9 to 93.3,41.5

### Footprints (pad centres in the part's own frame; a part is rotated, then mirrored left to right if it is on the bottom)
WCAP-CSGP_0805_H0.8_R = smd 0.9 x 1.3: 1 -0.95,0; 2 0.95,0
WCAP-CSGP_1210_H2.5 = smd 0.9 x 2.5: 1 -1.55,0; 2 1.55,0
WCAP-CSGP_0805_H1.25_R = smd 0.9 x 1.3: 1 -0.95,0; 2 0.95,0
WCAP-ASLI_12.5X14(DXL) = smd 5.8 x 2.5: 1 5.05,0; 2 -5.05,0
WCAP-CSGP_1206_H0.8 = smd 0.9 x 1.6: 1 -1.55,0; 2 1.55,0
WE-TVSP_DO-214AB_BIDIRECTIONAL = smd 2.3 x 3.3: 1 -3.5,0; 2 3.5,0
WL-SMTW_3528 = smd 1.6 x 2.4: 1 -1.425,0; 2 1.425,0
SMC = smd 2.8 x 3.8: A 3.7,0; C -3.7,0
WE-TVS_SOT23-3L = smd 0.9 x 1.4: 1 -0.95,-1.05; 2 0.95,-1.05; 3 0,1.05
WE-TVS_SOT143-4L = smd 1.4 x 1.4: 1 -0.75,-1.1 | smd 1 x 1.4: 2 0.95,-1.1; 3 0.95,1.1; 4 -0.95,1.1
SMA_DO-214AC = smd 1.778 x 2.159: A 2.05,0; C -2.05,0
61302211821 = drill 1.02: 1 -26.67,0; 2 -24.13,0; 3 -21.59,0; 4 -19.05,0; 5 -16.51,0; 6 -13.97,0; 7 -11.43,0; 8 -8.89,0; 9 -6.35,0; 10 -3.81,0; 11 -1.27,0; 12 1.27,0; 13 3.81,0; 14 6.35,0; 15 8.89,0; 16 11.43,0; 17 13.97,0; 18 16.51,0; 19 19.05,0; 20 21.59,0; 21 24.13,0; 22 26.67,0
INF-PG-TO252-3-11_N = smd 1.75 x 0.95: 1 -3.55,2.28; 3 -3.55,-2.28 | smd 6.6 x 5.6: 2 3.55,0
638207222005 = drill 1.5: 1 -10.16,2.54; 2 -5.08,2.54; 3 0,2.54; 4 5.08,2.54; 5 10.16,2.54; A1 -10.16,-2.54; A2 -5.08,-2.54; A3 0,-2.54; A4 5.08,-2.54; A5 10.16,-2.54
645004114822 = drill 1.8: 1 5.94,0.5; 2 1.98,0.5; 3 -1.98,0.5; 4 -5.94,0.5
61300421121 = drill 1.1: 1 -1.27,-1.27; 2 -1.27,1.27; 3 1.27,-1.27; 4 1.27,1.27
61300621121 = drill 1.1: 1 -2.54,-1.27; 2 -2.54,1.27; 3 0,-1.27; 4 0,1.27; 5 2.54,-1.27; 6 2.54,1.27
638207222007 = drill 1.5: 1 -15.24,2.54; 2 -10.16,2.54; 3 -5.08,2.54; 4 0,2.54; 5 5.08,2.54; 6 10.16,2.54; 7 15.24,2.54; A1 -15.24,-2.54; A2 -10.16,-2.54; A3 -5.08,-2.54; A4 0,-2.54; A5 5.08,-2.54; A6 10.16,-2.54; A7 15.24,-2.54
638207222008 = drill 1.5: 1 -17.78,2.54; 2 -12.7,2.54; 3 -7.62,2.54; 4 -2.54,2.54; 5 2.54,2.54; 6 7.62,2.54; 7 12.7,2.54; 8 17.78,2.54; A1 -17.78,-2.54; A2 -12.7,-2.54; A3 -7.62,-2.54; A4 -2.54,-2.54; A5 2.54,-2.54; A6 7.62,-2.54; A7 12.7,-2.54; A8 17.78,-2.54
R0805 = smd 1.3 x 1.5: 1 -0.95,0; 2 0.95,0
R1206 = smd 1.6 x 1.803: 1 -1.422,0; 2 1.422,0
4312560837X6 = drill 1: 1 -3.5,1.25; 2 -2.25,-1.25; 3 2.25,-1.25; 4 3.5,1.25
SOP65P600X115-15N-V = smd 1.31 x 0.45: 1 -2.85,1.95; 2 -2.85,1.3; 3 -2.85,0.65; 4 -2.85,0; 5 -2.85,-0.65; 6 -2.85,-1.3; 7 -2.85,-1.95; 8 2.85,-1.95; 9 2.85,-1.3; 10 2.85,-0.65; 11 2.85,0; 12 2.85,0.65; 13 2.85,1.3; 14 2.85,1.95 | smd 2.65 x 4: 15 0,0
SOIC127P602X173-8N-V = smd 1.47 x 0.65: 1 -2.765,1.905; 2 -2.765,0.635; 3 -2.765,-0.635; 4 -2.765,-1.905; 5 2.765,-1.905; 6 2.765,-0.635; 7 2.765,0.635; 8 2.765,1.905

### Placement (x,y rotation side)
C1  73.04,40.66 90 top
C2  29.86,40.66 90 top
C3  47.64,31.14 90 top
C4  38.75,23.74 0 top
C5  32.4,40.66 90 top
C6  27.32,31.14 90 top
C7  18.43,23.74 0 top
C8  28.59,23.74 0 top
C9  48.91,23.74 0 top
C10  90.12,67.89 180 top
C12  81.76,72.93 270 top
C13  67.96,31.14 90 top
C14  59.07,23.74 0 top
C15  79.83,78.51 270 top
C16  69.23,23.74 0 top
C17  53.99,64.79 0 top
C18  70.5,40.66 90 top
C19  53.99,53.98 0 top
C20  88.28,31.14 90 top
C21  79.39,23.74 0 top
C22  89.55,23.74 0 top
C23  85.74,50.8 180 top
C24  60.24,85.47 270 top
C25  57.9,85.47 270 top
C26  50.18,65.41 270 top
C27  47.64,65.41 270 top
C31  27.42,85.22 270 top
C32  17.16,65.41 270 top
C33  29.76,85.47 270 top
C34  19.7,65.41 270 top
C39  37.58,85.47 270 top
C40  27.32,65.41 270 top
C41  39.92,85.47 270 top
C42  32.4,65.41 270 top
C47  47.74,85.47 270 top
C48  37.48,65.41 270 top
C49  50.08,85.47 270 top
C50  40.02,65.41 270 top
D0  8.52,18.43 0 top
D1  19.06,17.8 0 top
D2  27.95,17.8 180 top
D3  39.38,17.8 0 top
D4  48.02,17.8 180 top
D5  89.3,84.73 180 top
D006  87.01,76.2 90 top
D7  68.59,17.8 180 top
D8  59.7,17.8 0 top
D9  88.66,17.8 180 top
D10  80.03,17.8 0 top
D11  81.51,86.41 0 top
D12  48.91,60.96 90 top
D13  18.43,60.96 90 top
D014  18.43,21.15 180 top
D15  28.59,60.96 90 top
D016  38.75,21.15 180 top
D17  38.75,60.96 90 top
D018  48.91,21.15 0 top
D019  28.59,21.15 0 top
D020  59.07,21.15 180 top
D021  69.23,21.15 0 top
D022  79.39,21.15 180 top
D023  89.55,21.15 0 top
ESP32-J1  36.21,69.85 180 top
ESP32-J3  36.21,46.99 180 top
G1  81.93,64.77 135 top
J1  81.93,7.62 180 top
J2  85.74,94.48 180 top
J4  73.04,59.69 0 top
J5  87.26,40.66 0 top
J7  15.89,93.98 0 top
J8  46.37,93.98 0 top
J9  18.18,40.66 0 top
J13  15.89,7.62 180 top
J15  48.91,7.62 180 top
R1  81.49,82.28 90 top
R2  45.13,35.12 270 top
R3  78.95,82.28 90 top
R4  42.53,35.12 270 top
R5  65.45,35.12 270 top
R6  62.85,35.12 270 top
R7  34.94,40.66 270 top
R8  67.96,40.66 270 top
R9  85.77,35.12 270 top
R10  27.32,40.66 270 top
R11  83.17,35.12 270 top
R12  75.58,40.66 270 top
R13  22.21,35.12 270 top
R14  42.56,52.07 270 top
R15  22.24,52.07 270 top
R16  45.1,52.07 270 top
R17  47.64,52.07 270 top
R18  24.81,35.12 270 top
R19  50.18,52.07 270 top
R20  61.61,52.07 270 top
R21  24.55,85.22 90 top
R22  26.05,80.14 90 top
R23  17.16,74.3 270 top
R24  32.63,85.22 90 top
R25  31.13,80.14 90 top
R26  19.7,74.3 270 top
R27  63.11,85.22 90 top  (not fitted)
R28  55.03,85.22 90 top  (not fitted)
R29  61.61,80.14 90 top
R30  56.53,80.14 90 top
R31  50.18,74.3 270 top
R32  47.64,74.3 270 top
R33  19.7,52.07 270 top
R34  59.07,52.07 270 top
R35  23.64,39.44 270 top
R36  43.83,39.44 270 top
R37  64.15,39.44 270 top
R38  81.21,39.44 270 top
R39  34.71,85.22 90 top  (not fitted)
R40  36.21,80.14 90 top
R41  27.32,74.3 270 top
R42  42.79,85.22 90 top  (not fitted)
R43  41.29,80.14 90 top
R44  32.4,74.3 270 top
R51  44.87,85.22 90 top
R52  46.37,80.14 90 top
R53  37.48,74.3 270 top
R54  52.95,85.22 90 top
R55  51.7,80.14 90 top
R56  40.02,74.3 270 top
RESET  5.26,82 270 top
RX1  15.13,16.53 90 top
RX2  31.89,16.53 270 top
RX3  35.45,16.53 90 top
RX4  51.96,16.53 270 top
RX5  92.6,16.53 270 top
RX6  72.53,16.53 270 top
RX7  55.77,16.53 90 top
RX8  76.09,16.53 90 top
U2  23.51,29.23 270 top
U3  43.83,29.23 270 top
U4  53.99,59.08 270 top
U5  64.15,29.23 270 top
U6  84.47,29.23 270 top

### Tracks (layer width: path | path; a pad name or v marks a point on that pad's centre or on a via)
+3V3  (via drill 0.35)
  Top 1.016: D13.4 17.33,58.59 v17.16,58.42 | D15.4 27.49,58.59 v27.32,58.42 | D17.4 37.65,58.59 v37.48,58.42 | D12.4 47.81,58.59 v47.64,58.42 | U4.5 52.09,54.93 C19.1 53.04,52.39 v52.72,52.07
  pour Route15 (isolate 0.35, rank 2): 2.12,40.86 2.12,99.1 94.43,99.1 94.43,40.86 2.65,40.86
+5V  (via drill 0.35)
  Top 1.016: U4.3 53.35,64.47 C17.1 53.04,66.36 | v53.99,68.33 53.99,67.31 53.04,66.36 | v52.83,68.04 53.04,67.72 53.04,66.36
  Route15 1.016: ESP32-J1.21 14.46,67.31 52.97,67.31 v53.99,68.33 54.14,68.42 55.26,67.31 71.77,67.31 74.31,69.85 | v78.12,71.12 76.85,72.39 75.58,71.12 | 74.31,69.85 75.58,71.12 | v76.85,69.85 75.58,71.12 | v75.58,68.58 74.31,69.85
  other vias: 73.04,54.61 79.39,69.85 78.12,69.85 76.85,68.58 76.85,67.31 78.12,68.58 78.12,67.31 79.39,67.31 79.39,68.58 80.66,68.58 80.66,67.31 81.93,67.31 81.93,66.04 80.66,66.04 80.66,64.77 79.39,64.77 79.39,66.04 78.12,66.04 80.66,69.85 81.93,68.58 83.2,67.31 83.2,66.04 80.66,63.5 79.39,63.5 78.12,64.77 76.85,66.04 75.58,67.31 79.39,71.12 81.93,64.77 67.96,60.96 13.35,71.12 11.05,71.12 11.05,68.58 13.35,68.58 12.08,71.12 12.08,68.58
  pour Top: 83.84,70.86 82.4,72.39 78.12,72.39 66.06,60.33 73.04,53.34 83.84,64.23
  pour Route15 (isolate 0.254, no thermals): 10.81,71.39 13.6,71.39 13.6,68.35 10.81,68.35
  pour Top (isolate 0.254, no thermals): 10.81,71.39 13.6,71.39 13.6,68.35 10.81,68.35
  pour Bottom (isolate 0.254, no thermals): 10.81,71.39 13.6,71.39 13.6,68.35 10.81,68.35
  pour Bottom: 83.84,70.86 82.4,72.39 78.12,72.39 66.06,60.33 73.04,53.34 83.84,64.23
+6V
  pour Top (isolate 0.254, no thermals): 69.23,19.32 72.02,19.32 72.02,16.28 69.23,16.28
AGNDU2  (via drill 0.35)
  Top 0.254: U2.1 C6.2 v27.32,33.04 | R10.2 v27.32,38.12
  Bottom 0.254: v27.32,38.12 v27.32,33.04
AGNDU3  (via drill 0.35)
  Top 0.254: U3.1 C3.2 v47.64,33.04 | R7.2 v34.94,38.12
  Bottom 0.254: v34.94,38.12 37.48,35.58 46.37,35.58 47.64,34.31 v47.64,33.04
AGNDU4  (via drill 0.35)
  Top 0.254: U5.1 C13.2 v67.96,33.04 | R8.2 v67.96,38.12
  Bottom 0.254: v67.96,38.12 v67.96,33.04
AGNDU5  (via drill 0.35)
  Top 0.254: U6.1 C20.2 v88.28,33.04 | R12.2 v75.58,38.12
  Bottom 0.254: v75.58,38.12 78.12,35.58 87.01,35.58 88.28,34.31 v88.28,33.04
CAN1_RXD
  Top 0.254: ESP32-J1.5 52.72,69.39 51.89,68.56 51.89,67.72 52.16,67.46 52.16,61.91 U4.4
CAN1_TXD
  Top 0.254: U4.1 55.89,65.56 56.06,65.73 56.06,69.05 ESP32-J1.4
CAN_N
  Top 0.254: U4.6 53.35,57.55 53.74,57.94 53.74,58.63 55.3,60.19 60.84,60.19 76.85,76.2 76.85,77.47 | J2.1 79.39,93.57 79.39,86.52 D11.1 78.95,83.75 R3.2 77.53,83.23 76.85,82.55 76.85,77.47 | 76.85,77.47
CAN_P
  Top 0.254: U4.7 54.62,57.55 54.24,57.94 54.24,58.42 55.51,59.69 61.05,59.69 77.56,76.2 80.66,76.2 83.2,78.74 83.2,82.55 82.52,83.23 R1.2 82.46,84.2 D11.2 84.47,87.37 84.47,93.27 J2.2
CI1
  Top 0.508: D13.3 16.77,61.91 15.7,62.98 15.7,65.49 C32.1 ESP32-J1.19 R23.2 17.16,73.62 17.87,74.33 21.67,74.33 R22.1
CI2
  Top 0.508: R25.1 28.83,78.72 27.37,77.25 25.78,77.25 21.4,72.87 R26.2 ESP32-J1.18 C34.1 19.7,66.83 21.26,65.28 21.26,63.45 19.72,61.91 D13.2
CI3
  Top 0.508: D15.3 26.73,61.91 25.86,62.78 25.86,65.23 27.32,66.7 C40.1 ESP32-J1.15 R41.2 27.32,73.19 31.39,77.25 32.2,77.25 33.68,78.74 36.18,78.74 R40.1
CI4
  Top 0.508: D15.2 29.69,62.2 29.42,62.48 29.42,65.23 31.13,66.95 C42.1 ESP32-J1.13 R44.2 33.61,72.87 34.22,73.48 34.22,76.75 34.73,77.25 38.04,77.25 39.5,78.72 R43.1
CI5
  Top 0.508: D17.3 37.14,61.91 36.02,63.03 36.02,64.98 37.48,66.44 C48.1 ESP32-J1.11 R53.2 37.48,73.37 38.44,74.33 41.99,74.33 R52.1
CI6
  Top 0.508: R55.1 50.24,77.25 46.1,77.25 42.26,73.42 40.57,73.42 R56.2 ESP32-J1.10 C50.1 40.02,66.83 41.58,65.28 41.58,63.2 40.29,61.91 D17.2
CI7
  Top 0.508: D12.3 47.05,61.91 46.18,62.78 46.18,64.73 47.64,66.19 C27.1 ESP32-J1.7 R32.2 47.64,73.62 48.35,74.33 52.15,74.33 R30.1
CI8
  Top 0.508: R29.1 59.57,78.72 58.11,77.25 56.38,77.25 52.04,72.91 50.22,72.91 R31.2 ESP32-J1.6 C26.1 50.18,65.82 51.48,64.51 51.48,63.2 50.2,61.91 D12.2
ECU_GND  (via drill 0.35)
  Top 1.016: D13.1 19.53,58.59 v19.7,58.42 | D15.1 29.69,58.59 v29.86,58.42 | D17.1 40.02,60.04 v40.02,58.42 | D12.1 50.18,60.04 v50.18,58.42 | U4.8 55.89,54.93 C19.2 54.94,53.68 v56.53,52.09 | C17.2 54.62,64.47 U4.2
  other vias: 73.04,73.64 71.77,73.64 74.06,74.91 48.91,57.93 51.45,58.44 50.18,53.36 44.97,53.74 47.64,53.61 51.96,42.18 83.58,74.31 34.94,43.2 32.4,43.2 29.86,44.47 27.32,43.2 69.36,47.77 66.69,48.28 57.8,53.36 57.8,54.63 50.18,54.63 92.09,60.98 92.09,58.44 87.01,74.95 92.09,55.9 92.09,48.28 92.09,45.74 92.6,42.18 75.58,43.2 73.04,43.2 70.5,44.47 67.96,43.2 57.8,52.09 38.75,63.27 28.08,65.55 18.43,65.55 48.66,65.81 54.88,66.19 77.83,80.01 81.13,78.78 81.61,91.43 81.61,90.16 81.61,95.49 81.61,96.51 83.58,75.58 83.58,76.86 82.31,76.47 80.66,58.44 79.39,57.17 81.93,57.17 83.2,57.17 83.2,62.25 80.66,59.71 83.2,58.44 81.93,58.44 81.93,59.71 28.59,92.73 33.67,92.73 38.75,92.73 43.83,92.73 48.91,92.73 53.99,92.73 59.07,92.73 64.15,92.73 23.51,92.73 75.58,48.28 76.85,47.01 78.12,45.74 79.39,44.47 51.45,44.47 64.15,43.2 41.29,44.47 56.53,49.55 74.31,49.55 80.66,43.2 27.19,85.47 29.99,85.72 32.27,84.96 35.07,84.96 37.35,85.47 40.15,85.72 42.94,84.96 44.97,84.96 47.51,85.85 50.31,85.72 57.93,85.47 60.21,85.47 58.31,79.12 48.15,78.74 49.67,79.12 37.99,78.99 33.03,79.88 27.83,79.63 24.14,79.12 29.73,77.09 21.35,71.5 25.8,71.37 52.85,84.96 55.13,84.96 53.48,78.11 54.62,78.99 41.29,53.36 37.35,53.11 36.21,53.11 34.94,52.6 33.67,53.23 32.4,52.09 31.26,53.23 29.86,53.11 28.59,52.98 28.59,48.28 31.13,48.28 33.67,48.28 36.21,48.28 38.75,48.28 26.05,48.28 26.05,52.09 26.05,50.82 31.13,57.17 33.67,58.44 32.4,58.44 23.51,58.42 13.35,58.42 6.62,59.31 13.35,62.23 9.54,58.42 14.62,73.66 2.56,41.78 3.82,41.78 12.71,41.78 10.18,41.78 6.37,41.78 76.85,92.73 74.31,92.73 70.5,92.73 66.69,92.73 25.41,56.9 25.67,61.34 25.8,59.18 29.61,56.01 32.91,56.52 35.45,55.88 35.83,61.59 33.8,62.36 33.8,68.45 31,68.45 28.59,68.45 23.51,68.45 20.97,68.45 43.83,68.45 46.5,68.45 43.7,56.77 46.12,60.96 49.42,60.45 57.16,61.21 56.91,68.45 59.07,68.45 61.61,68.45 60.34,61.34 61.48,58.67 76.72,73.91 74.18,71.37 77.96,77.25 82.28,79.92 77.83,78.65 78.46,86.36 77.95,90.04 75.54,82.93 75.54,79.5 83.33,72.79 90.31,76.73 90.44,75.46 41.8,71.75 45.73,71.75 51.96,71.5 63.26,71.88 22.24,53.61 23.51,48.41 20.97,48.41 19.7,53.74 18.43,63.27 31.38,65.55 30.62,64.66 30.62,63.39 33.92,66.06 38.75,65.81 48.91,63.27 54.62,63.27 57.04,63.39 2.17,50.16 1.54,51.69 3.57,51.69 6.11,55.88 1.29,59.31 7,51.56 28.72,71.12 31,71.25 33.67,71.25 36.21,71.25 32.91,76.45 30.37,73.91 41.92,76.96 51.58,76.96 41.42,48.51 38.75,45.09 44.46,44.7 47.89,44.96 53.99,45.59 52.97,49.02 59.07,48.39 59.07,45.59
  pour Top (isolate 0.45, rank 2): 0.65,40.86 0.65,99.1 94.43,99.1 94.43,40.86
  pour Bottom (isolate 0.45, rank 2): 0.65,40.86 0.65,99.1 94.43,99.1 94.43,40.86
  pour Route2 (isolate 0.254, rank 2): 2.12,40.86 2.12,99.1 94.43,99.1 94.43,40.86 2.65,40.86
ECU_PWR
  Top 1.27: J7.3 J7.A3 | J7.A4 J7.4
  pour Top (isolate 0.305): 84.33,78.08 84.33,97.19 90.12,97.19 90.12,78.08
  pour Bottom (isolate 0.254): 84.33,40.86 84.33,97.19 90.12,97.19 90.12,40.86
  pour Top (isolate 0.254): 83.06,40.86 83.06,43.85 91.39,43.85 91.39,40.86
  pour Bottom (isolate 0.254): 83.06,40.86 83.06,43.85 91.39,43.85 91.39,40.86
  pour Top (isolate 0.45): 90.12,93.84 2.12,93.84 2.12,99.1 90.12,99.1
I1
  Top 0.508: 26.05,87.63 R22.2 | R21.2 25.06,86.64 26.05,87.63 | C31.1 26.91,86.77 26.05,87.63 | 26.05,87.63 J7.A5 J7.5
I2
  Top 0.508: 31.13,87.63 R25.2 | C33.1 30.52,87.02 31.13,87.63 | R24.2 32.12,86.64 31.13,87.63 | 31.13,87.63 J8.A1 J8.1
I3
  Top 0.508: 36.21,87.63 R40.2 | R39.2 35.22,86.64 36.21,87.63 | C39.1 36.82,87.02 36.21,87.63 | 36.21,87.63 J8.A2 J8.2
I4
  Top 0.508: 41.29,87.63 R43.2 | C41.1 40.68,87.02 41.29,87.63 | R42.2 42.28,86.64 41.29,87.63 | 41.29,87.63 J8.A3 J8.3
I5
  Top 0.508: 46.37,87.63 R52.2 | R51.2 45.38,86.64 46.37,87.63 | C47.1 46.98,87.02 46.37,87.63 | 46.37,87.63 J8.A4 J8.4
I6
  Top 0.508: 51.45,87.63 51.45,81.81 R55.2 | C49.1 50.84,87.02 51.45,87.63 | R54.2 52.44,86.64 51.45,87.63 | 51.45,87.63 J8.A5 J8.5
I7
  Top 0.508: 56.53,87.63 J8.A6 J8.6 | 56.53,87.63 R30.2 | R28.2 55.54,86.64 56.53,87.63 | C25.1 57.14,87.02 56.53,87.63
I8
  Top 0.508: 61.61,87.63 J8.A7 J8.7 | 61.61,87.63 R29.2 | C24.1 61,87.02 61.61,87.63 | R27.2 62.6,86.64 61.61,87.63
N$1
  pour Top (isolate 0.254, no thermals): 48.91,19.32 51.7,19.32 51.7,16.28 48.91,16.28
N$2
  Top 0.254: R2.2 U3.2
N$3
  pour Top (isolate 0.254, no thermals): 90.12,74.33 90.12,53.91 84.47,48.26 76.85,48.26 76.85,53.34 81.93,53.34 84.33,55.74 84.33,74.33
N$4
  Top 0.254: R4.2 U3.6
N$5
  Top 0.254: R5.2 U5.2
N$6
  pour Top (isolate 0.254): 28.59,19.32 31.38,19.32 31.38,16.28 28.59,16.28
N$8
  pour Top (isolate 0.254, no thermals): 15.64,19.32 18.43,19.32 18.43,16.28 15.64,16.28
N$9
  pour Top (isolate 0.254, no thermals): 35.96,19.32 38.75,19.32 38.75,16.28 35.96,16.28
N$10
  Top 0.254: R18.2 U2.2
N$11
  Top 0.254: R6.2 U5.6
N$12
  Top 0.254: R9.2 U6.2
N$13
  Top 0.254: R11.2 U6.6
N$14
  Top 0.254: R13.2 U2.6
N$15
  pour Top (isolate 0.254, no thermals): 89.55,19.32 92.34,19.32 92.34,16.28 89.55,16.28
N$17
  Top 0.406: R3.1 79.83,80.44 | 79.83,80.44 79.83,80.7 80.46,81.33 R1.1 | 79.83,80.44 C15.1
N$18
  pour Top (isolate 0.254, no thermals): 56.28,19.32 59.07,19.32 59.07,16.28 56.28,16.28
N$19
  pour Top (isolate 0.254, no thermals): 76.6,19.32 79.39,19.32 79.39,16.28 76.6,16.28
PWR  (via drill 0.3)
  other vias: 23.51,28.73 23.51,29.73 23.51,30.73 23.51,27.73 24.51,27.73 25.51,27.73 22.51,27.73 21.51,27.73 21.51,28.73 21.51,29.73 21.51,30.73 22.51,30.73 22.51,29.73 22.51,28.73 24.51,28.73 24.51,29.73 24.51,30.73 25.51,30.73 25.51,29.73 25.51,28.73 43.83,29.73 43.83,30.73 43.83,28.73 43.83,27.73 44.83,27.73 44.83,28.73 44.83,29.73 44.83,30.73 45.83,30.73 45.83,29.73 45.83,28.73 45.83,27.73 42.83,27.73 42.83,28.73 42.83,29.73 42.83,30.73 41.83,30.73 41.83,29.73 41.83,28.73 41.83,27.73 29.13,25.38 30.4,25.38 31.67,25.38 32.94,25.38 34.21,25.38 35.48,25.38 36.75,25.38 38.02,25.38 17.7,25.38 16.43,25.38 15.16,25.38 13.89,25.38 12.62,23.38 10.08,23.38 10.08,24.65 10.08,25.92 12.62,38.62 12.62,37.35 12.62,36.08 34.21,37.1 50.91,37.08 50.91,35.81 50.91,34.54 50.91,33.27 36.94,39.62 38.21,39.62 38.21,38.35 36.94,38.35 25.76,38.35 25.76,39.62 64.15,28.73 64.15,29.73 64.15,30.73 64.15,27.73 65.15,27.73 66.15,27.73 63.15,27.73 62.15,27.73 62.15,28.73 62.15,29.73 62.15,30.73 63.15,30.73 63.15,29.73 63.15,28.73 65.15,28.73 65.15,29.73 65.15,30.73 66.15,30.73 66.15,29.73 66.15,28.73 84.47,29.73 84.47,30.73 84.47,28.73 84.47,27.73 85.47,27.73 85.47,28.73 85.47,29.73 85.47,30.73 86.47,30.73 86.47,29.73 86.47,28.73 86.47,27.73 83.47,27.73 83.47,28.73 83.47,29.73 83.47,30.73 82.47,30.73 82.47,29.73 82.47,28.73 82.47,27.73 69.77,25.38 71.04,25.38 72.31,25.38 73.58,25.38 74.85,25.38 76.12,25.38 77.39,25.38 78.66,25.38 58.34,25.38 57.07,25.38 55.8,25.38 54.53,25.38 53.26,25.38 50.72,25.38 50.72,26.65 50.72,27.92 53.26,38.62 53.26,37.35 53.26,36.08 74.85,37.1 91.55,37.08 91.55,35.81 91.55,34.54 91.55,33.27 77.58,39.62 78.85,39.62 78.85,38.35 77.58,38.35 66.4,38.35 66.4,39.62 90.12,25.38 91.12,25.38 92.12,25.38 93.12,25.38
  pour Top (isolate 0.254, rank 3): 8.47,20.34 8.47,40.14 94.43,40.14 94.43,20.34
  pour Top (isolate 0.254, rank 3): 8.52,2.54 8.52,23.26 13.15,23.26 13.15,2.54
  pour Bottom (isolate 0.254, rank 3): 8.47,20.34 8.47,40.14 94.43,40.14 94.43,20.34
  pour Bottom (isolate 0.254, rank 2): 8.47,2.54 8.47,23.26 13.15,23.26 13.15,2.54
PWR_GND  (via drill 0.35)
  other vias: 5.73,16.53 4.46,16.53 4.46,17.8 5.73,19.07 4.46,20.34 5.73,21.61 7,21.61 5.73,20.34 5.73,22.88 7,24.15 5.73,25.42 7,26.69 5.73,27.96 7,29.23 5.73,30.5 7,31.77 5.73,33.04 7,34.31 5.73,35.58 7,36.85 5.73,38.12 7,39.39 5.73,39.39 14.62,12.72 15.89,12.72 17.16,12.72 29.86,12.72 31.13,12.72 32.4,12.72 34.94,12.72 36.21,12.72 37.48,12.72 50.18,12.72 51.45,12.72 52.72,12.72 55.26,12.72 56.53,12.72 57.8,12.72 70.5,12.72 71.77,12.72 73.04,12.72 75.58,12.72 76.85,12.72 78.12,12.72 90.82,12.72 92.09,12.72 93.36,12.72 29.86,15.26 32.4,15.26 31.13,15.26 34.94,15.26 36.21,15.26 37.48,15.26 50.18,15.26 51.45,15.26 52.72,15.26 55.26,15.26 56.53,15.26 57.8,15.26 70.5,15.26 71.77,15.26 73.04,15.26 75.58,15.26 76.85,15.26 78.12,15.26 90.82,15.26 92.09,15.26 93.36,15.26 93.36,13.99 92.09,13.99 90.82,13.99 78.12,13.99 76.85,13.99 75.58,13.99 73.04,13.99 71.77,13.99 70.5,13.99 57.8,13.99 56.53,13.99 55.26,13.99 52.72,13.99 51.45,13.99 50.18,13.99 37.48,13.99 36.21,13.99 34.94,13.99 32.4,13.99 31.13,13.99 29.86,13.99 17.16,15.26 15.89,15.26 14.62,15.26 14.62,13.99 15.89,13.99 17.16,13.99 4.46,13.99 4.46,12.72 5.73,12.72 7,12.72 7,13.99 7,15.26 5.73,15.26 4.46,15.26 5.73,13.99
  pour Top (isolate 0.254, rank 2): 13.6,2.54 13.6,24.25 18.05,24.25 18.05,2.54
  pour Top (isolate 0.254, rank 2): 28.97,24.25 38.37,24.25 38.37,2.54 28.97,2.54
  pour Top (isolate 0.254, rank 2): 49.29,24.25 53.79,24.25 53.79,2.54 49.29,2.54
  pour Top (isolate 0.45, rank 2): 8.07,2.54 1.65,2.54 1.65,40.14 8.07,40.14
  pour Route2 (isolate 0.254, rank 4): 3.39,3.83 3.39,40.46 94.43,40.46 94.43,3.83
  pour Route15 (isolate 0.254, rank 4): 3.39,3.83 3.39,40.46 94.43,40.46 94.43,3.83
  pour Bottom (isolate 0.45, rank 4): 94.43,2.54 1.65,2.54 1.65,40.14 94.43,40.14
  pour Top (isolate 0.254, rank 2): 54.19,2.54 54.19,24.25 58.69,24.25 58.69,2.54
  pour Top (isolate 0.254, rank 2): 69.61,24.25 74.11,24.25 74.11,2.54 69.61,2.54
  pour Top (isolate 0.254, rank 2): 74.51,24.25 79.01,24.25 79.01,2.54 74.51,2.54
  pour Top (isolate 0.254, rank 2): 89.93,24.25 94.43,24.25 94.43,2.54 89.93,2.54
Q1
  pour Top (isolate 0.254, rank 2): 18.76,2.54 18.76,24.91 20.77,26.92 23.13,26.92 23.13,2.54
Q1C  (via drill 0.35)
  Top 0.25: R33.2 ESP32-J3.18
  Top 0.254: v22.21,40.66 R13.1
  Bottom 0.254: v22.21,40.66 22.21,44.45 19.7,46.96 ESP32-J3.18
Q2
  pour Top (isolate 0.254, rank 2): 23.89,26.92 26.05,26.92 28.26,24.71 28.26,2.54 23.89,2.54
Q2C
  Top 0.25: ESP32-J3.17 R15.2
  Top 0.254: R18.1 24.81,44.45 24.78,44.45 ESP32-J3.17
Q3
  pour Top (isolate 0.254, rank 2): 39.08,2.56 39.08,24.91 41.09,26.92 43.45,26.92 43.45,2.56
Q3C
  Top 0.25: R14.2 ESP32-J3.9
  Top 0.254: R4.1 41.43,36.07 40.02,37.48 40.02,44.45 ESP32-J3.9
Q4
  pour Top (isolate 0.254, rank 2): 44.21,26.92 46.78,26.92 48.58,25.12 48.58,2.54 44.21,2.54
Q4C  (via drill 0.35)
  Top 0.25: R16.2 ESP32-J3.8
  Top 0.254: v45.35,40.66 45.13,40.44 R2.1
  Bottom 0.254: ESP32-J3.8 45.35,46.74 v45.35,40.66
Q5
  pour Top (isolate 0.254, rank 2): 59.4,2.54 59.4,24.91 61.41,26.92 63.77,26.92 63.77,2.54
Q5C  (via drill 0.35)
  Top 0.25: R17.2 ESP32-J3.7
  Top 0.254: v62.72,40.66 62.72,36.2 R6.1
  Bottom 0.254: v62.72,40.66 62.72,43.2 51.45,43.2 47.66,46.99 ESP32-J3.7
Q6
  pour Top (isolate 0.254, rank 2): 64.53,26.92 66.69,26.92 68.9,24.71 68.9,2.54 64.53,2.54
Q6C  (via drill 0.35)
  Top 0.25: R19.2 ESP32-J3.6
  Top 0.254: v65.58,40.66 65.58,36.2 R5.1
  Bottom 0.254: v65.58,40.66 65.58,43.02 64.13,44.47 52.7,44.47 ESP32-J3.6
Q7
  pour Top (isolate 0.254, rank 2): 79.72,2.54 79.72,24.91 81.73,26.92 84.09,26.92 84.09,2.54
Q7C  (via drill 0.35)
  Top 0.25: ESP32-J3.4 57.74,49.47 60.13,49.47 61.3,50.65 R20.2
  Top 0.254: R11.1 81.31,36.07 79.77,37.61 v79.77,40.66
  Bottom 0.254: v79.77,40.66 79.77,42.8 73.04,49.53 57.8,49.53 ESP32-J3.4
Q8
  pour Top (isolate 0.254, rank 2): 84.85,26.92 87.42,26.92 89.22,25.12 89.22,2.54 84.85,2.54
Q8C  (via drill 0.35)
  Top 0.25: ESP32-J3.5 56.38,50.65 R34.2
  Top 0.254: R9.1 85.77,36.2 84.37,37.6 82.98,37.6 82.69,37.89 v82.69,40.66
  Bottom 0.254: v82.69,40.66 82.69,42.44 74.33,50.8 56.53,50.8 ESP32-J3.5
RESET
  Bottom 0.508: ESP32-J1.3 51.62,76.03 44.17,76.03 42.18,78.02 29.35,78.02 28.8,77.47 9.54,77.47 8.11,76.05 5.91,76.05 4.01,77.94 RESET.3
U2IS
  Top 0.25: U2.4 23.51,38.36 R35.2
U3IS
  Top 0.25: R36.2 U3.4
U5IS
  Top 0.254: R37.2 U5.4
U6IS
  Top 0.254: R38.2 82.6,37.1 84.08,37.1 84.47,36.71 U6.4

### Text on the board
tPlace: Breite: 101,8 mm, Länge: 96,3 mm | nutzbare Breite: 99 mm, Länge: 95 mm
tNames: M | M | + | + | I1 | I2 | I3 | I4 | I5 | I6 | I7 | I8 | L | H | + | M | M | M | + | + | L | H | P | M | +5V | ECU_GND | ECU_PWR | PWR | PWR | PWR_GND | PWR_GND | M | + | M | Q1 | Q2 | M | M | Q3 | Q4 | M | M | Q5 | Q6 | M | M | Q7 | Q8 | M
bNames: ECU_GND | ECU_PWR | PWR_GND | PWR | PWR_GND | PWR